# Altium project Power_Sys_Toplvl.PrjPCB (part 1 of 2)
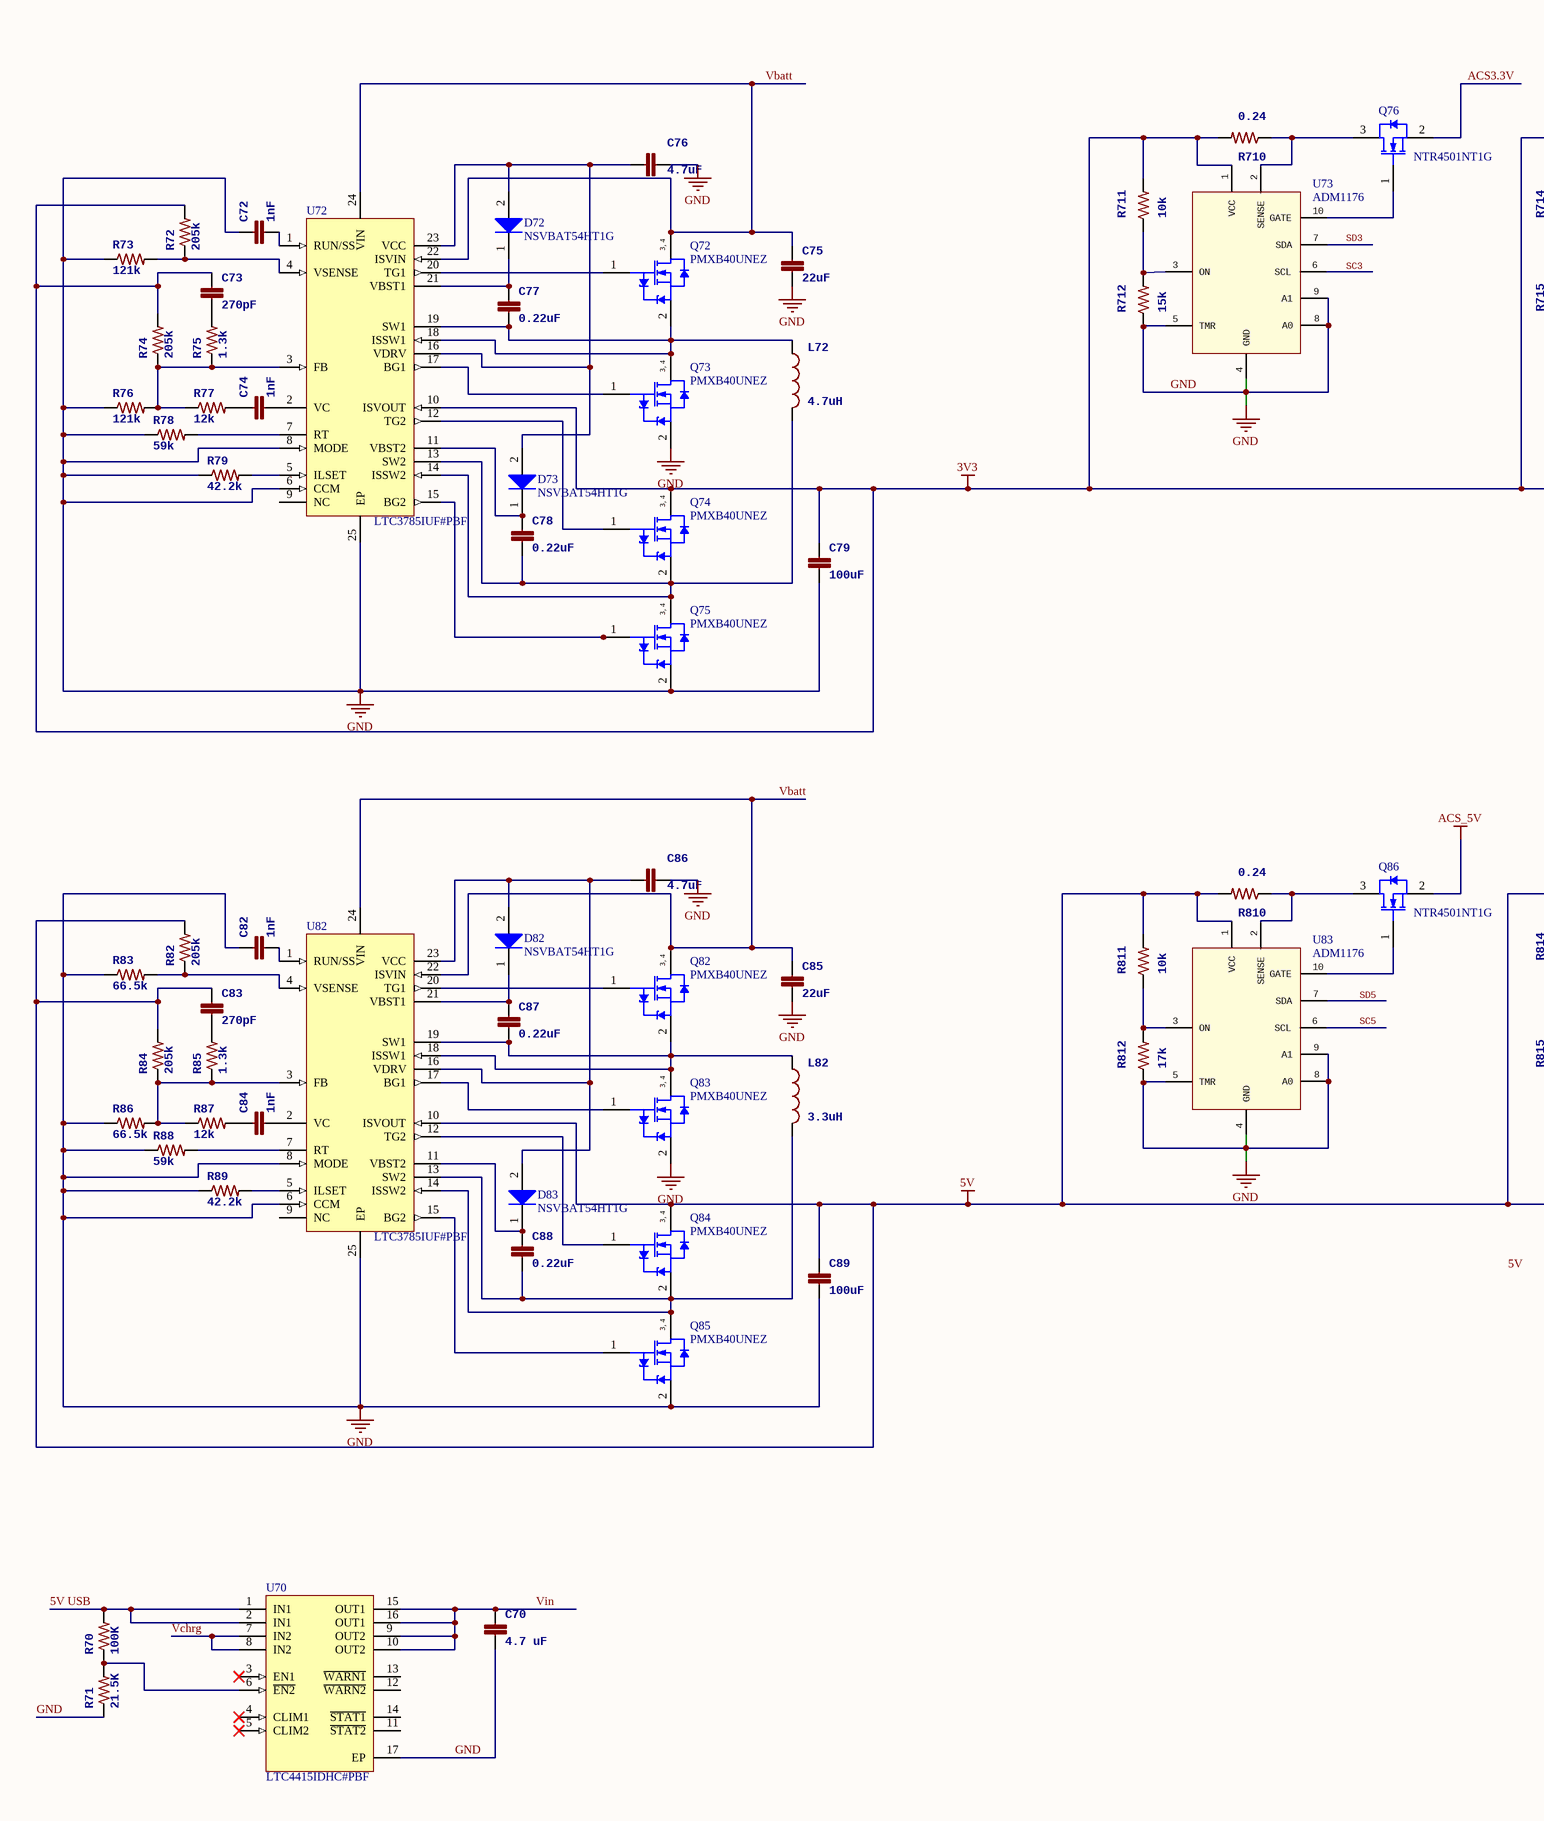
[diagram p0: BCR.SchDoc, left]
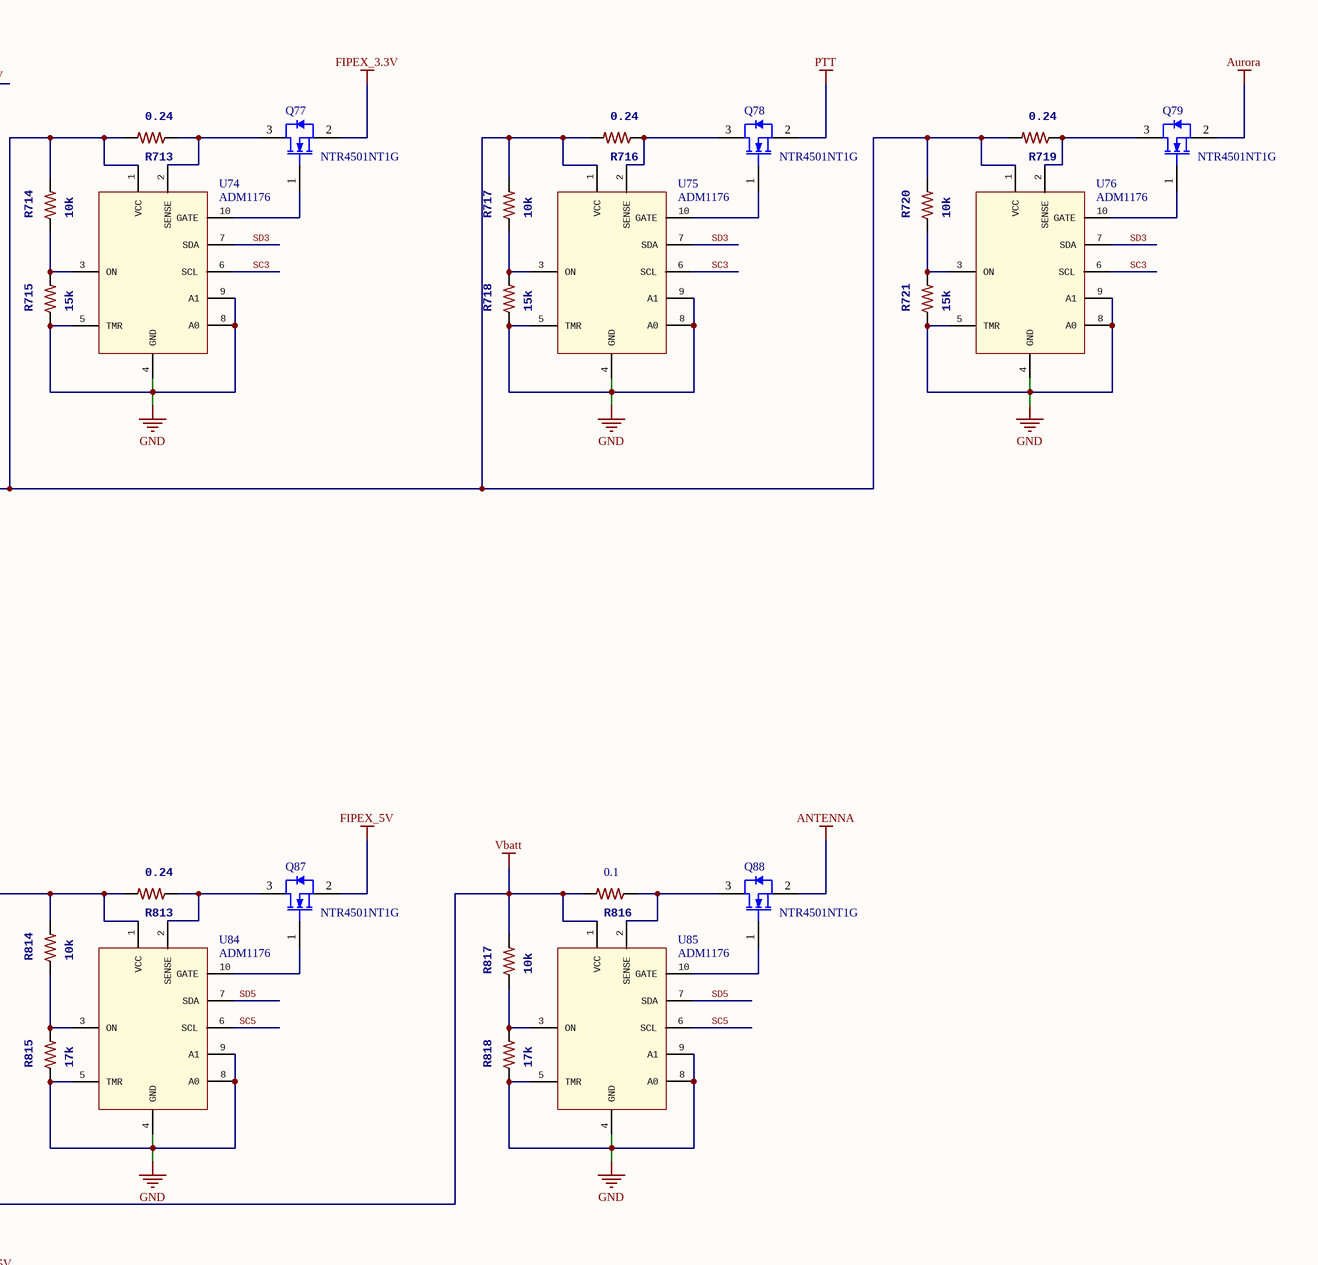
[diagram p1: BCR.SchDoc, right]
12 sheets, 551 parts. Net scope: hierarchical (ports join the sheet entries above them; power ports are global).
Sheets:
  BCR.SchDoc
  MPPT_Measurements.SchDoc
  MPPT-BCR.SchDoc
  power_board_uC.SchDoc
  Power_Sys_Toplvl.SchDoc
    PowerBoard = power_board_2.SchDoc.SchDoc
    SolarArray1 = SolarArray1.SchDoc
    SolarArray2 = SolarArray2.SchDoc
    SolarArray3 = SolarArray3.SchDoc
    SolarArray4 = SolarArray4.SchDoc
    SolarArrayTop = SolarArrayTop.SchDoc
    BatteryBoard = Battery4p.SchDoc

## Sheet BCR.SchDoc
size A2; Author: H. Chesser; DrawnBy: H. Chesser

### Parts
C70  4.7 uF  [0805]
C72  1nF  [0402-CAP]
C73  270pF  [0402-CAP]
C74  1nF  [0402-CAP]
C75  22uF  [0805]
C76  4.7uF  [0805]
C77  0.22uF  [0805]
C78  0.22uF  [0805]
C79  100uF  [0805]
C82  1nF  [0402-CAP]
C83  270pF  [0402-CAP]
C84  1nF  [0402-CAP]
C85  22uF  [0805]
C86  4.7uF  [0805]
C87  0.22uF  [0805]
C88  0.22uF  [0805]
C89  100uF  [0805]
D72  NSVBAT54HT1G  [ONSC-SOD-323-2-477-02_V]
D73  NSVBAT54HT1G  [ONSC-SOD-323-2-477-02_V]
D82  NSVBAT54HT1G  [ONSC-SOD-323-2-477-02_V]
D83  NSVBAT54HT1G  [ONSC-SOD-323-2-477-02_V]
L72  4.7uH  [1007]
L82  3.3uH  [1007]
Q72  PMXB40UNEZ  [NXP-SOT1215_M]
Q73  PMXB40UNEZ  [NXP-SOT1215_M]
Q74  PMXB40UNEZ  [NXP-SOT1215_M]
Q75  PMXB40UNEZ  [NXP-SOT1215_M]
Q76  NTR4501NT1G  [ONSC-SOT-23-3-318-08_V]
Q77  NTR4501NT1G  [ONSC-SOT-23-3-318-08_V]
Q78  NTR4501NT1G  [ONSC-SOT-23-3-318-08_V]
Q79  NTR4501NT1G  [ONSC-SOT-23-3-318-08_V]
Q82  PMXB40UNEZ  [NXP-SOT1215_M]
Q83  PMXB40UNEZ  [NXP-SOT1215_M]
Q84  PMXB40UNEZ  [NXP-SOT1215_M]
Q85  PMXB40UNEZ  [NXP-SOT1215_M]
Q86  NTR4501NT1G  [ONSC-SOT-23-3-318-08_V]
Q87  NTR4501NT1G  [ONSC-SOT-23-3-318-08_V]
Q88  NTR4501NT1G  [ONSC-SOT-23-3-318-08_V]
R70  100K  [0805]
R71  21.5K  [0805]
R72  205k  [0603-RES]
R73  121k  [0603-RES]
R74  205k  [0603-RES]
R75  1.3k  [0603-RES]
R76  121k  [0603-RES]
R77  12k  [0603-RES]
R78  59k  [0603-RES]
R79  42.2k  [0603-RES]
R82  205k  [0603-RES]
R83  66.5k  [0603-RES]
R84  205k  [0603-RES]
R85  1.3k  [0603-RES]
R86  66.5k  [0603-RES]
R87  12k  [0603-RES]
R88  59k  [0603-RES]
R89  42.2k  [0603-RES]
R710  0.24  [RESC1220X06N]
R711  10k  [0603-RES]
R712  15k  [0603-RES]
R713  0.24  [RESC1220X06N]
R714  10k  [0603-RES]
R715  15k  [0603-RES]
R716  0.24  [RESC1220X06N]
R717  10k  [0603-RES]
R718  15k  [0603-RES]
R719  0.24  [RESC1220X06N]
R720  10k  [0603-RES]
R721  15k  [0603-RES]
R810  0.24  [RESC1220X06N]
R811  10k  [0603-RES]
R812  17k  [0603-RES]
R813  0.24  [RESC1220X06N]
R814  10k  [0603-RES]
R815  17k  [0603-RES]
R816  value 0.1  [0603-RES]  (hidden comment: 0603)
R817  10k  [0603-RES]
R818  17k  [0603-RES]
U70  LTC4415IDHC#PBF  [LT-DHC-16_A_V]
U72  LTC3785IUF#PBF  [LT-UF-24_M]
U73  ADM1176  [MSOP-10]
U74  ADM1176  [MSOP-10]
U75  ADM1176  [MSOP-10]
U76  ADM1176  [MSOP-10]
U82  LTC3785IUF#PBF  [LT-UF-24_M]
U83  ADM1176  [MSOP-10]
U84  ADM1176  [MSOP-10]
U85  ADM1176  [MSOP-10]

### Nets
3V3: C73.1 C79.1 Q74.3(D) Q74.4(D) R72.2 R74.2 R710.2 R711.2 R713.2 R714.2 R716.2 R717.2 R719.2 R720.2 U72.10(ISVOUT) U73.1(VCC) U74.1(VCC) U75.1(VCC) U76.1(VCC)
5V: C75.1 C83.1 C85.1 C89.1 Q72.3(D) Q72.4(D) Q82.3(D) Q82.4(D) Q84.3(D) Q84.4(D) R82.2 R84.2 R810.2 R811.2 R813.2 R814.2 R816.2 R817.2 U72.22(ISVIN) U72.24(VIN) U82.10(ISVOUT) U82.22(ISVIN) U82.24(VIN) U83.1(VCC) U84.1(VCC) U85.1(VCC)  [also labelled Vbatt]
ACS_5V: Q86.2(S)
ANTENNA: Q88.2(S)
Aurora: Q79.2(S)
FIPEX_3.3V: Q77.2(S)
FIPEX_5V: Q87.2(S)
GND: C70.2 C72.1 C75.2 C76.2 C79.2 C82.1 C85.2 C86.2 C89.2 Q73.2(S) Q75.2(S) Q83.2(S) Q85.2(S) R71.1 R73.1 R76.1 R78.1 R79.1 R83.1 R86.1 R88.1 R89.1 R712.1 R715.1 R718.1 R721.1 R812.1 R815.1 R818.1 U70.17(EP) U72.6(CCM) U72.8(MODE) U72.25(EP) U73.4(GND) U73.5(TMR) U73.8(A0) U73.9(A1) U74.4(GND) U74.5(TMR) U74.8(A0) U74.9(A1) U75.4(GND) U75.5(TMR) U75.8(A0) U75.9(A1) U76.4(GND) U76.5(TMR) U76.8(A0) U76.9(A1) U82.6(CCM) U82.8(MODE) U82.25(EP) U83.4(GND) U83.5(TMR) U83.8(A0) U83.9(A1) U84.4(GND) U84.5(TMR) U84.8(A0) U84.9(A1) U85.4(GND) U85.5(TMR) U85.8(A0) U85.9(A1)  [project net ARRAYNX.3.NEG.NEG]
PTT: Q78.2(S)
5V USB: R70.2 U70.1(IN1) U70.2(IN1)
ACS3.3V: Q76.2(S)
SC3: U74.6(SCL) U75.6(SCL) U76.6(SCL)
SC5: U83.6(SCL) U84.6(SCL) U85.6(SCL)
SD3: U73.7(SDA) U74.7(SDA) U75.7(SDA) U76.7(SDA)
SD5: U84.7(SDA) U85.7(SDA)
Vchrg: U70.7(IN2) U70.8(IN2)
Vin: C70.1 U70.9(OUT2) U70.10(OUT2) U70.15(OUT1) U70.16(OUT1)
NetC72_2: C72.2 U72.1(RUN/SS)
NetC73_2: C73.2 R75.2
NetC74_1: C74.1 R77.2
NetC74_2: C74.2 U72.2(VC)
NetC76_1: C76.1 D72.2(A) D73.2(A) U72.16(VDRV) U72.23(VCC)
NetC77_1: C77.1 D72.1(K) U72.21(VBST1)
NetC77_2: C77.2 L72.1 Q72.2(S) Q73.3(D) Q73.4(D) U72.18(ISSW1) U72.19(SW1)
NetC78_1: C78.1 D73.1(K) U72.11(VBST2)
NetC78_2: C78.2 L72.2 Q74.2(S) Q75.3(D) Q75.4(D) U72.13(SW2) U72.14(ISSW2)
NetC82_2: C82.2 U82.1(RUN/SS)
NetC83_2: C83.2 R85.2
NetC84_1: C84.1 R87.2
NetC84_2: C84.2 U82.2(VC)
NetC86_1: C86.1 D82.2(A) D83.2(A) U82.16(VDRV) U82.23(VCC)
NetC87_1: C87.1 D82.1(K) U82.21(VBST1)
NetC87_2: C87.2 L82.1 Q82.2(S) Q83.3(D) Q83.4(D) U82.18(ISSW1) U82.19(SW1)
NetC88_1: C88.1 D83.1(K) U82.11(VBST2)
NetC88_2: C88.2 L82.2 Q84.2(S) Q85.3(D) Q85.4(D) U82.13(SW2) U82.14(ISSW2)
NetQ72_1: Q72.1(G) U72.20(TG1)
NetQ73_1: Q73.1(G) U72.17(BG1)
NetQ74_1: Q74.1(G) U72.12(TG2)
NetQ75_1: Q75.1(G) U72.15(BG2)
NetQ76_1: Q76.1(G) U73.10(GATE)
NetQ76_3: Q76.3(D) R710.1 U73.2(SENSE)
NetQ77_1: Q77.1(G) U74.10(GATE)
NetQ77_3: Q77.3(D) R713.1 U74.2(SENSE)
NetQ78_1: Q78.1(G) U75.10(GATE)
NetQ78_3: Q78.3(D) R716.1 U75.2(SENSE)
NetQ79_1: Q79.1(G) U76.10(GATE)
NetQ79_3: Q79.3(D) R719.1 U76.2(SENSE)
NetQ82_1: Q82.1(G) U82.20(TG1)
NetQ83_1: Q83.1(G) U82.17(BG1)
NetQ84_1: Q84.1(G) U82.12(TG2)
NetQ85_1: Q85.1(G) U82.15(BG2)
NetQ86_1: Q86.1(G) U83.10(GATE)
NetQ86_3: Q86.3(D) R810.1 U83.2(SENSE)
NetQ87_1: Q87.1(G) U84.10(GATE)
NetQ87_3: Q87.3(D) R813.1 U84.2(SENSE)
NetQ88_1: Q88.1(G) U85.10(GATE)
NetQ88_3: Q88.3(D) R816.1 U85.2(SENSE)
NetR70_1: R70.1 R71.2 U70.6(~{EN2})
NetR72_1: R72.1 R73.2 U72.4(VSENSE)
NetR74_1: R74.1 R75.1 R76.2 R77.1 U72.3(FB)
NetR78_2: R78.2 U72.7(RT)
NetR79_2: R79.2 U72.5(ILSET)
NetR82_1: R82.1 R83.2 U82.4(VSENSE)
NetR84_1: R84.1 R85.1 R86.2 R87.1 U82.3(FB)
NetR88_2: R88.2 U82.7(RT)
NetR89_2: R89.2 U82.5(ILSET)
NetR711_1: R711.1 R712.2 U73.3(ON)
NetR714_1: R714.1 R715.2 U74.3(ON)
NetR717_1: R717.1 R718.2 U75.3(ON)
NetR720_1: R720.1 R721.2 U76.3(ON)
NetR811_1: R811.1 R812.2 U83.3(ON)
NetR814_1: R814.1 R815.2 U84.3(ON)
NetR817_1: R817.1 R818.2 U85.3(ON)

Not connected (* = marked no-connect by the designer): U70 3(EN1)* 4(CLIM1)* 5(CLIM2)* 11(~{STAT2}) 12(~{WARN2}) 13(~{WARN1}) 14(~{STAT1}); U72 9(NC); U73 6(SCL); U82 9(NC); U83 7(SDA)

### Notes on the sheet
- Labels drawn without touching a wire or pin: 5V, SC3, SD5
- (in symbol CMP-1258-00046-1) 3, 4

### Library data of the parts
C70 = CAP0805_4700nF: Tolerance: ±10%; Voltage - Rated: 10V; Temperature Coefficient: X5R; RoHS: RoHS Compliant; Category: Capacitors; Packaging: Tape & Reel (TR); Mounting Type: Surface Mount, MLCC; Operating Temperature: -55°C ~ 125°C; Applications: General Purpose; Ratings: -; Package / Case: 0805 (2012 Metric); Size / Dimension: 0.079" L x 0.049" W (2.00mm x 1.25mm); Thickness (Max): 0.039" (1.00mm); Value: 4.7 uF; Supplier 1: Digi-Key; Supplier Part Number 1: 709-1230-1-ND
C72-C74 C82-C84 = CAP0402-CAP: Supplier 1: Digi-Key
  C72 C74 C82 C84: Supplier Part Number 1: 490-1303-1-ND
  C73 C83: Supplier Part Number 1: 1276-1673-1-ND
C75-C79 C85-C89 = CAP0805: Manufacturer: Kemet; Manufacturer Part Number: C0805C105K8RACTU; Tolerance: ±10%; Voltage - Rated: 10V; Temperature Coefficient: X7R; RoHS: RoHS Compliant; Category: Capacitors; Packaging: Tape & Reel (TR); Mounting Type: Surface Mount, MLCC; Operating Temperature: -55°C ~ 125°C; Applications: General Purpose; Ratings: -; Package / Case: 0805 (2012 Metric); Size / Dimension: 0.079" L x 0.049" W (2.00mm x 1.25mm); Height - Seated (Max): -; Thickness (Max): 0.039" (1.00mm); Lead Spacing: -; Features: -; Lead Style: -; ComponentLink1URL: http://www.kemet.com/docfinder?Partnumber=C0805C105K8RACTU; ComponentLink1Description: http://www.kemet.com/docfinder?Partnumber=C0805C105K8RACTU; Supplier 1: Digi-Key
  C75 C85: Supplier Part Number 1: 490-1719-1-ND
  C76 C86: Supplier Part Number 1: 490-3338-1-ND
  C77 C78 C87 C88: Supplier Part Number 1: 490-1670-1-ND
  C79 C89: Supplier Part Number 1: 490-10510-1-ND
D72 D73 D82 D83 = CMP-1055-00464-1: Schottky Barrier Diode, 2-Pin SOD-323, Pb-Free, Tape and Reel; Manufacturer: On Semiconductor; Configuration: Single; IFSM Max (A): 0.6; trr Max (ns): 5; ComponentLink1URL: http://www.onsemi.com/; ComponentLink2URL: http://www.onsemi.cn/pub_link/Collateral/BAT54HT1-D.PDF; ComponentLink2Description: Datasheet; PackageReference: SOD-323-2-477-02; ComponentLink3URL: http://www.onsemi.com/pub_link/Collateral/477-02.PDF.1; Mounting Technology: Surface Mount; DatasheetVersion: Rev. 6; PartNumber: NSVBAT54HT1G; ComponentLink3Description: Package Specification; PackageDescription: 2-Pin SOD, Body 1.7 x 1.25 mm; RoHS: TRUE; PackageVersion: Rev. H, 03/2007; Packing: Tape and Reel; ComponentLink1Description: Manufacturer URL
L72 L82 = INDUCTOR1007: Supplier 1: Digi-Key
  L72: Supplier Part Number 1: 587-1621-1-ND
  L82: Supplier Part Number 1: 587-2186-1-ND
Q72-Q75 Q82-Q85 = CMP-1258-00046-1: N-Channel Trench MOSFET, 12 V, 3.2 A, -55 to 150 degC, 4-Pin SOT1215; Manufacturer: NXP Semiconductors; VDS [max] (V): 12; Coss [typ] (pF): 107; Ciss [typ] (pF): 556; Channel Type: N; VGSth [typ] (V): 0.65; ID [max] (A): 3.2; ComponentLink1URL: http://www.nxp.com/; PackageVersion: 13-03-06, 03/2013; ComponentLink2URL: http://www.nxp.com/documents/data_sheet/PMXB40UNE.pdf; PartNumber: PMXB40UNEZ; PackageReference: SOT1215; Mounting Technology: Surface Mount; ComponentLink2Description: Datasheet; ComponentLink3URL: http://www.nxp.com/documents/outline_drawing/sot1215_po.pdf; ComponentLink3Description: Package Specification; PackageDescription: 3-Pin Small Outline No-Lead, Body 1.1 x 1 mm, Pitch 0.75 mm; ComponentLink1Description: Manufacturer URL; DatasheetVersion: Rev. 1
Q76-Q79 Q86-Q88 = CMP-1058-00732-1: Power MOSFET, 20 V, 3.2 A, Single N-Channel, 3-Pin SOT-23, Pb-Free, Tape and Reel; Manufacturer: On Semiconductor; VGS Max (V): 12; VGS(th) Max (V): 1.2; PD Max (W): 1.25; Coss Typ (pF): 80; Ciss Typ (pF): 200; V(BR)DSS Min (V): 20; Qrr Typ (nC): 3; Crss Typ (pF): 50; Channel Polarity: N Channel; RoHS: Pb-Free; ComponentLink3URL: http://www.onsemi.cn/pub_link/Collateral/318-08.PDF; ComponentLink2Description: Datasheet; PackageVersion: Rev. AP, 11/2009; Mounting Technology: Surface Mount; PackageDescription: 3-Pin Small Outline Transistor, Body 2.92 x 1.3 mm, Pitch 0.95 mm; PackageReference: SOT-23-3-318-08; ComponentLink1URL: http://www.onsemi.com/; Packing: Tape and Reel; Configuration: Single; ComponentLink2URL: http://www.onsemi.cn/pub_link/Collateral/NTR4501N-D.PDF; ComponentLink3Description: Package Specification; Package Type: SOT-23-3; ComponentLink1Description: Manufacturer URL; PartNumber: NTR4501NT1G; DatasheetVersion: Rev. 13
R70 = RES_0805_100K: Manufacturer: TE Connectivity; Manufacturer Part Number: 1625856-2; Resistance (Ohms): 10K; Tolerance: ±10%; Power (Watts): 0.125W, 1/8W; Temperature Coefficient: ±100ppm/°C; RoHS: RoHS Compliant; Category: Resistors; Packaging: Cut Tape (CT); Composition: Thick Film; Features: -; Operating Temperature: -55°C ~ 125°C; Package / Case: 0805 (2012 Metric); Supplier Device Package: 0805; Size / Dimension: 0.079" L x 0.047" W (2.00mm x 1.20mm); Height: 0.020" (0.50mm); Number of Terminations: 2; ComponentLink1URL: http://www.te.com/commerce/DocumentDelivery/DDEController?Action=srchrtrv&DocNm=1625856&DocType=Customer+Drawing&DocLang=English; ComponentLink1Description: http://www.te.com/commerce/DocumentDelivery/DDEController?Action=srchrtrv&DocNm=1625856&DocType=Customer+Drawing&DocLang=English; Value: 100K; Supplier 1: Digi-Key; Supplier Part Number 1: 311-100KCRCT-ND
R71 = RES_0805_21_5K: Manufacturer: TE Connectivity; Manufacturer Part Number: 1625856-2; Resistance (Ohms): 15K; Tolerance: ±10%; Power (Watts): 0.125W, 1/8W; Temperature Coefficient: ±100ppm/°C; RoHS: RoHS Compliant; Category: Resistors; Packaging: Cut Tape (CT); Composition: Thick Film; Features: -; Operating Temperature: -55°C ~ 125°C; Package / Case: 0805 (2012 Metric); Supplier Device Package: 0805; Size / Dimension: 0.079" L x 0.047" W (2.00mm x 1.20mm); Height: 0.020" (0.50mm); Number of Terminations: 2; ComponentLink1URL: http://www.te.com/commerce/DocumentDelivery/DDEController?Action=srchrtrv&DocNm=1625856&DocType=Customer+Drawing&DocLang=English; ComponentLink1Description: http://www.te.com/commerce/DocumentDelivery/DDEController?Action=srchrtrv&DocNm=1625856&DocType=Customer+Drawing&DocLang=English; Value: 21.5K; Supplier 1: Digi-Key; Supplier Part Number 1: 541-21.5KCCT-ND
R72-R79 R82-R89 R710-R721 R810-R815 R817 R818 = RESISTOR0603-RES: Supplier 1: Digi-Key
  R72 R74: Supplier Part Number 1: P205KHTR-ND
  R73 R76: Supplier Part Number 1: P121KHTR-ND
  R75 R85: Supplier Part Number 1: P1.30KHTR-ND
  R77: Supplier Part Number 1: P12.0KHTR-ND
  R78: Supplier Part Number 1: P59.0KHTR-ND
  R79 R89: Supplier Part Number 1: P42.2KHTR-ND
  R82: Supplier Part Number 1: P205KHCT-ND
  R83: Supplier Part Number 1: P66.5KHTR-ND
  R84: Supplier Part Number 1: P205KHDKR-ND
  R86: Supplier Part Number 1: P66.5KHCT-ND
  R87: Supplier Part Number 1: P12.0KHCT-ND
  R88: Supplier Part Number 1: P59.0KHCT-ND
  R710 R713 R716 R719 R810 R813: Supplier Part Number 1: P16011TR-ND
  R711 R714 R717 R720 R811 R814 R817: Supplier Part Number 1: P10.0KHTR-ND
  R712 R715 R718 R721: Supplier Part Number 1: P15.0KHTR-ND
  R812 R818: Supplier Part Number 1: P16.9KHCT-ND
  R815: Supplier Part Number 1: P16.9KHTR-ND
R816 = RESISTOR0603-RES: =Value; Supplier 1: Digi-Key; Supplier Part Number 1: 311-.10QCT-ND
U70 = CMP-0479-00074-1: Dual 4 A Ideal Diode with Adjustable Current Limit, Imon Output, Overcurrent Warning, Thermal Warning, 1.7 to 5.5 V Vin, 16-pin DFN (DHC-16_A), -40 to 125 degC, Pb-Free; Manufacturer: Linear Technology; Ideal Diode: Dual, Internal, P-Channel; Code_JEDEC: MO-229; ComponentLink3URL: http://cds.linear.com/docs/en/datasheet/4415fa.pdf; ComponentLink2URL: http://cds.linear.com/docs/en/datasheet/4415fa.pdf; Mounting Technology: Surface Mount; PackageDescription: 16-Pin Plastic DFN, Body 5 x 3 mm, Pitch 0.5 mm; ComponentLink1Description: Manufacturer URL; ComponentLink1URL: http://www.linear.com/; PackageVersion: Rev. Ø; PartNumber: LTC4415IDHC#PBF; PackageReference: DHC-16; ComponentLink3Description: Package Specification; DatasheetVersion: Rev. Ø; ComponentLink2Description: Datasheet; RoHS: TRUE
U72 U82 = CMP-0492-02264-1: High Efficiency, Synchronous, No Rsense Buck-Boost Controller, 24-pin QFN (UF24), -40 to 125 degC, Pb-Free; Manufacturer: Linear Technology; Number of Outputs: 1; Code_JEDEC: MO-220; PartNumber: LTC3785IUF#PBF; ComponentLink1Description: Manufacturer URL; PackageReference: UF24; ComponentLink3Description: Package Specification; PackageDescription: 24-Pin Plastic QFN, Body 4 x 4 mm, Pitch 0.5 mm; PackageVersion: Rev. B, 02/2012; ComponentLink1URL: http://www.linear.com/; ComponentLink3URL: http://cds.linear.com/docs/en/packaging/%28UF24%29%20QFN%2005-08-1697%20Rev%20B.pdf; ComponentLink2Description: Datasheet; DatasheetVersion: Rev. C; ComponentLink2URL: http://cds.linear.com/docs/en/datasheet/3785fc.pdf; RoHS: TRUE; Mounting Technology: Surface Mount
U73-U76 U83-U85 = ADM1176: DataSheet: http://www.analog.com/static/imported-files/data_sheets/ADM1176.pdf; MPN: ADM1176; Supplier 1: Digi-Key; Supplier Part Number 1: ADM1176-1ARMZ-R7CT-ND

## Sheet MPPT_Measurements.SchDoc
size C
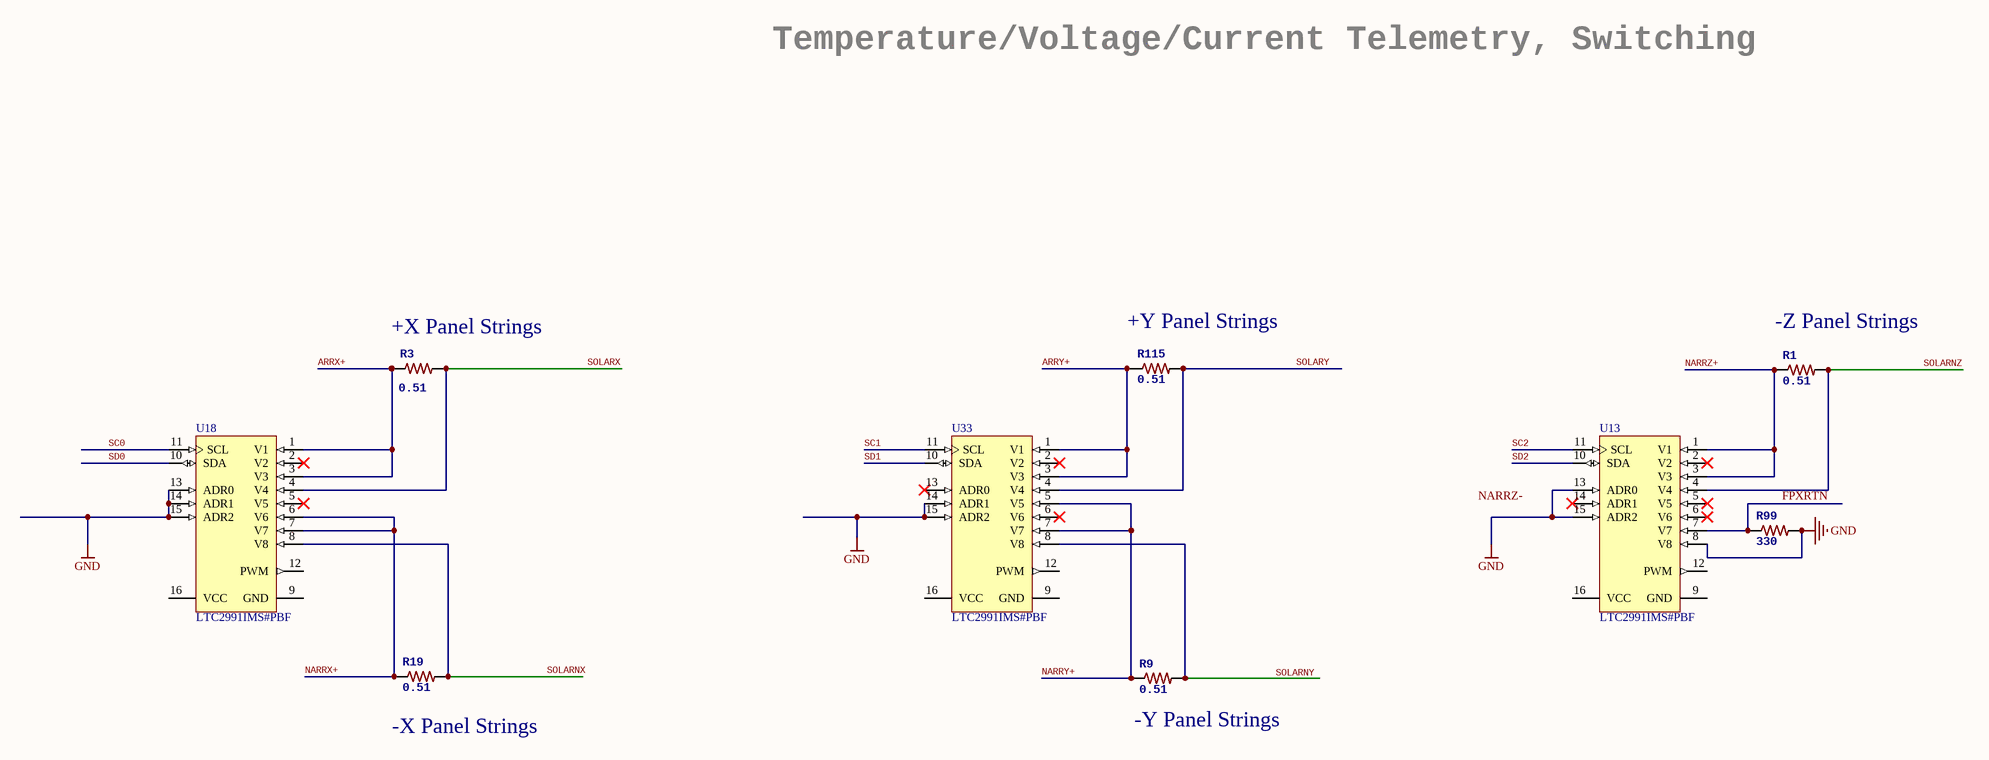
[diagram p2: MPPT_Measurements.SchDoc]

### Parts
(Parts that share a designator on the sheet are numbered #1, #2 ... from top to bottom, then left to right.)
R1#1  0.51  [RESC1220X06N]
R3#1  0.51  [RESC1220X06N]
R9  0.51  [RESC1220X06N]
R19  0.51  [RESC1220X06N]
R99  330  [0603-RES]
R115  0.51  [RESC1220X06N]
U13  LTC2991IMS#PBF  [LT-MS-16_N]
U18  LTC2991IMS#PBF  [LT-MS-16_N]
U33  LTC2991IMS#PBF  [LT-MS-16_N]

### Nets
GND: R99.2 U13.8(V8) U13.13(ADR0) U13.15(ADR2) U18.13(ADR0) U18.14(ADR1) U18.15(ADR2) U33.14(ADR1) U33.15(ADR2)  [project net ARRAYNX.3.NEG.NEG]
ARRX+: R3#1.1 U18.1(V1) U18.3(V3)
ARRY+: R115.1 U33.1(V1) U33.3(V3)
FPXRTN: R99.1 U13.7(V7)
NARRX+: R19.1 U18.6(V6) U18.7(V7)
NARRY+: R9.1 U33.5(V5) U33.7(V7)
NARRZ+: R1#1.1 U13.1(V1) U13.3(V3)
SC0: U18.11(SCL)
SC1: U33.11(SCL)
SC2: U13.11(SCL)
SD0: U18.10(SDA)
SD1: U33.10(SDA)
SD2: U13.10(SDA)
SOLARNX: R19.2 U18.8(V8)
SOLARNZ: R1#1.2 U13.4(V4)
SOLARX: R3#1.2 U18.4(V4)
SOLARY: R115.2 U33.4(V4)
NetR9_2: R9.2 U33.8(V8)

Not connected (* = marked no-connect by the designer): U13 2(V2)* 5(V5)* 6(V6)* 9(GND) 12(PWM) 14(ADR1)* 16(VCC); U18 2(V2)* 5(V5)* 9(GND) 12(PWM) 16(VCC); U33 2(V2)* 6(V6)* 9(GND) 12(PWM) 13(ADR0)* 16(VCC)

### Notes on the sheet
- Temperature/Voltage/Current Telemetry, Switching
- (near R3#1) +X Panel Strings
- (near R115) +Y Panel Strings
- (near R1#1) -Z Panel Strings
- (near R19) -X Panel Strings
- (near R9) -Y Panel Strings
- Labels drawn without touching a wire or pin: NARRZ-, SOLARNY

### Library data of the parts
R1#1 R9 R19 R115 = RESISTOR: <b>Resistor</b> / Basic schematic elements and footprints for 0603, 1206, and PTH resistors.; Supplier 1: Digi-Key; Supplier Part Number 1: RHM.51BSTR-ND; Value: 0.51
R3#1 = RESISTOR: <b>Resistor</b> / Basic schematic elements and footprints for 0603, 1206, and PTH resistors.; pin to pad: A1 A2 A3>P2 B1 B2 B3>P1; Supplier 1: Digi-Key; Supplier Part Number 1: RHM.51BSTR-ND; Value: 0.51
R99 = RESISTOR0805-RES_333: Manufacturer: TE Connectivity; Manufacturer Part Number: 1625856-2; Tolerance: ±10%; Power (Watts): 0.125W, 1/8W; Temperature Coefficient: ±100ppm/°C; RoHS: RoHS Compliant; Category: Resistors; Packaging: Cut Tape (CT); Value: 330; Composition: Thick Film; Features: -; Operating Temperature: -55°C ~ 125°C; Package / Case: 0805 (2012 Metric); Supplier Device Package: 0805; Size / Dimension: 0.079" L x 0.047" W (2.00mm x 1.20mm); Height: 0.020" (0.50mm); Number of Terminations: 2; ComponentLink1URL: http://www.te.com/commerce/DocumentDelivery/DDEController?Action=srchrtrv&DocNm=1625856&DocType=Customer+Drawing&DocLang=English; ComponentLink1Description: http://www.te.com/commerce/DocumentDelivery/DDEController?Action=srchrtrv&DocNm=1625856&DocType=Customer+Drawing&DocLang=English; Supplier 1: Digi-Key; Supplier Part Number 1: P332DBCT-ND
U13 U18 U33 = CMP-0482-00817-1: Octal I2C Voltage, Current, and Temperature Monitor, 16-pin SOP (MS-16), -40 to 85 degC, Pb-Free; Manufacturer: Linear Technology; Number of Supplies(#): 8; PackageDescription: 16-Pin Plastic MSOP, Body 4.04 x 3.00 mm, Pitch 0.50 mm; ComponentLink3Description: Package Specification; RoHS: TRUE; ComponentLink1URL: http://www.linear.com/; DatasheetVersion: Rev. B; ComponentLink1Description: Manufacturer URL; ComponentLink2Description: Datasheet; ComponentLink2URL: http://cds.linear.com/docs/en/datasheet/2991fb.pdf; PackageReference: MS16; PartNumber: LTC2991IMS#PBF; PackageVersion: Rev. Ø, 06/2010; ComponentLink3URL: http://cds.linear.com/docs/en/packaging/05081669_A_MS16.pdf; Mounting Technology: Surface Mount

## Sheet MPPT-BCR.SchDoc
size C
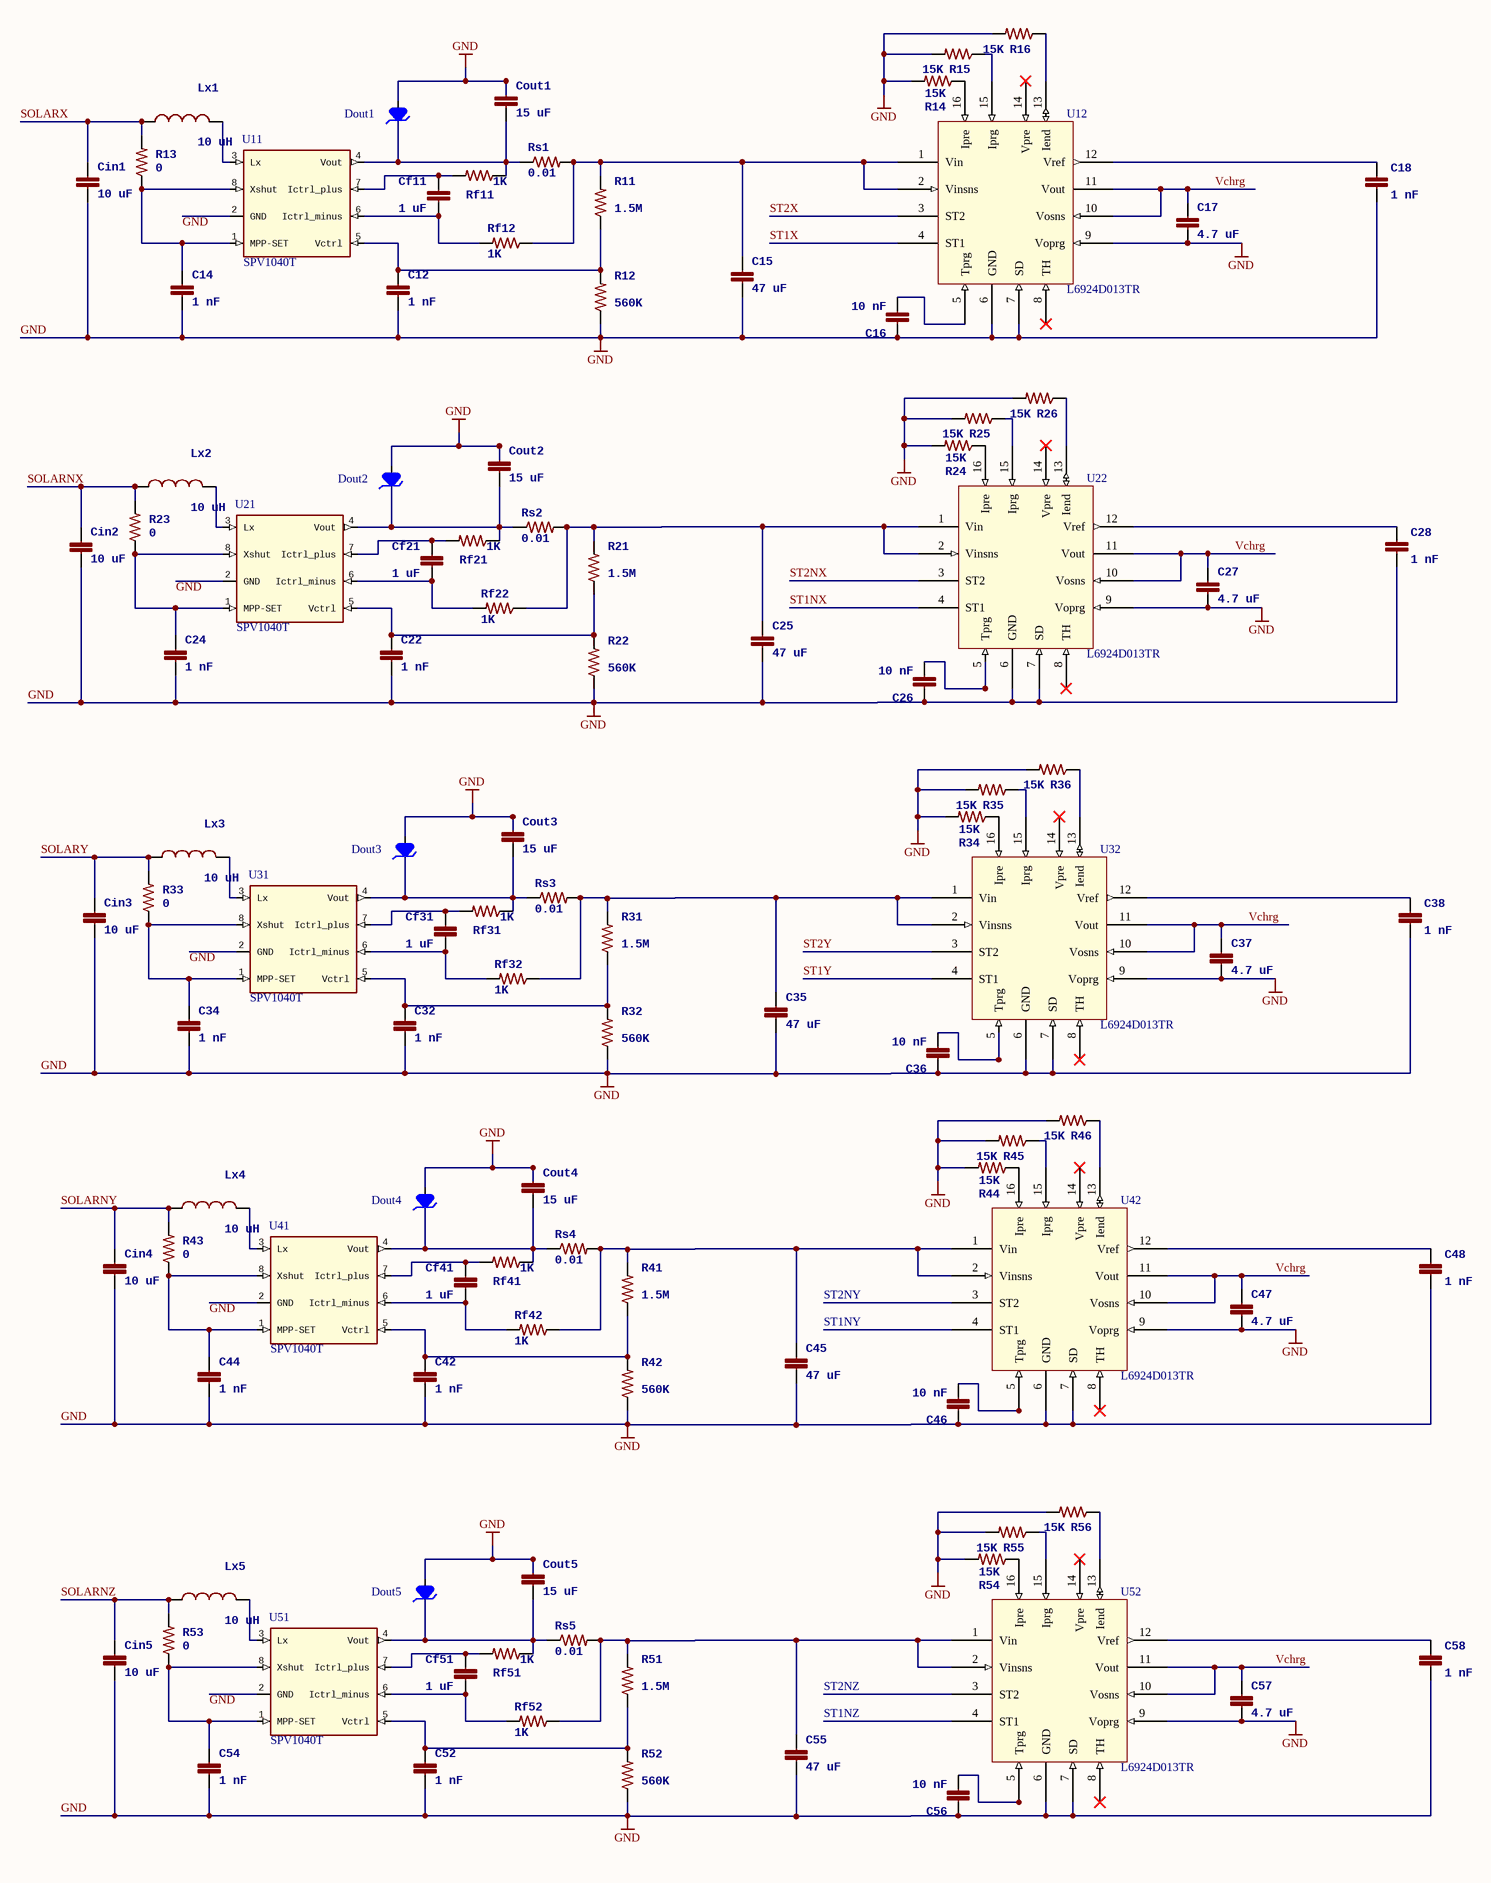
[diagram p3: MPPT-BCR.SchDoc]

### Parts
C12  1 nF  [0805]
C14  1 nF  [0805]
C15  47 uF  [0805]
C16  10 nF  [0805]
C17  4.7 uF  [0805]
C18  1 nF  [0805]
C22  1 nF  [0805]
C24  1 nF  [0805]
C25  47 uF  [0805]
C26  10 nF  [0805]
C27  4.7 uF  [0805]
C28  1 nF  [0805]
C32  1 nF  [0805]
C34  1 nF  [0805]
C35  47 uF  [0805]
C36  10 nF  [0805]
C37  4.7 uF  [0805]
C38  1 nF  [0805]
C42  1 nF  [0805]
C44  1 nF  [0805]
C45  47 uF  [0805]
C46  10 nF  [0805]
C47  4.7 uF  [0805]
C48  1 nF  [0805]
C52  1 nF  [0805]
C54  1 nF  [0805]
C55  47 uF  [0805]
C56  10 nF  [0805]
C57  4.7 uF  [0805]
C58  1 nF  [0805]
Cf11  1 uF  [0805]
Cf21  1 uF  [0805]
Cf31  1 uF  [0805]
Cf41  1 uF  [0805]
Cf51  1 uF  [0805]
Cin1  10 uF  [0805]
Cin2  10 uF  [0805]
Cin3  10 uF  [0805]
Cin4  10 uF  [0805]
Cin5  10 uF  [0805]
Cout1  15 uF  [1210]
Cout2  15 uF  [1210]
Cout3  15 uF  [1210]
Cout4  15 uF  [1210]
Cout5  15 uF  [1210]
Dout1  Diode_Zener  [STmite]  (value not drawn)
Dout2  Diode_Zener  [STmite]  (value not drawn)
Dout3  Diode_Zener  [STmite]  (value not drawn)
Dout4  Diode_Zener  [STmite]  (value not drawn)
Dout5  Diode_Zener  [STmite]  (value not drawn)
Lx1  10 uH  [1007]
Lx2  10 uH  [1007]
Lx3  10 uH  [1007]
Lx4  10 uH  [1007]
Lx5  10 uH  [1007]
R11  1.5M  [0805]
R12  560K  [0805]
R13  0  [0805]
R14  15K  [0805]
R15  15K  [0805]
R16  15K  [0805]
R21  1.5M  [0805]
R22  560K  [0805]
R23  0  [0805]
R24  15K  [0805]
R25  15K  [0805]
R26  15K  [0805]
R31  1.5M  [0805]
R32  560K  [0805]
R33  0  [0805]
R34  15K  [0805]
R35  15K  [0805]
R36  15K  [0805]
R41  1.5M  [0805]
R42  560K  [0805]
R43  0  [0805]
R44  15K  [0805]
R45  15K  [0805]
R46  15K  [0805]
R51  1.5M  [0805]
R52  560K  [0805]
R53  0  [0805]
R54  15K  [0805]
R55  15K  [0805]
R56  15K  [0805]
Rf11  1K  [0805]
Rf12  1K  [0805]
Rf21  1K  [0805]
Rf22  1K  [0805]
Rf31  1K  [0805]
Rf32  1K  [0805]
Rf41  1K  [0805]
Rf42  1K  [0805]
Rf51  1K  [0805]
Rf52  1K  [0805]
Rs1  0.01  [0805]
Rs2  0.01  [0805]
Rs3  0.01  [0805]
Rs4  0.01  [0805]
Rs5  0.01  [0805]
U11  Manufacturer Part Number: SPV1040T  [TSSOP8]  (hidden comment: SPV1040)
U12  L6924D013TR  [VQFN16_AP]
U21  Manufacturer Part Number: SPV1040T  [TSSOP8]  (hidden comment: SPV1040)
U22  L6924D013TR  [VQFN16_AP]
U31  Manufacturer Part Number: SPV1040T  [TSSOP8]  (hidden comment: SPV1040)
U32  L6924D013TR  [VQFN16_AP]
U41  Manufacturer Part Number: SPV1040T  [TSSOP8]  (hidden comment: SPV1040)
U42  L6924D013TR  [VQFN16_AP]
U51  Manufacturer Part Number: SPV1040T  [TSSOP8]  (hidden comment: SPV1040)
U52  L6924D013TR  [VQFN16_AP]

### Nets
GND: C12.2 C14.2 C15.2 C16.1 C17.2 C18.2 C22.2 C24.2 C25.2 C26.1 C27.2 C28.2 C32.2 C34.2 C35.2 C36.1 C37.2 C38.2 C42.2 C44.2 C45.2 C46.1 C47.2 C48.2 C52.2 C54.2 C55.2 C56.1 C57.2 C58.2 Cin1.2 Cin2.2 Cin3.2 Cin4.2 Cin5.2 Cout1.1 Cout2.1 Cout3.1 Cout4.1 Cout5.1 Dout1.2 Dout2.2 Dout3.2 Dout4.2 Dout5.2 R12.1 R14.2 R15.2 R16.2 R22.1 R24.2 R25.2 R26.2 R32.1 R34.2 R35.2 R36.2 R42.1 R44.2 R45.2 R46.2 R52.1 R54.2 R55.2 R56.2 U12.6(GND) U12.7(SD) U12.9(Voprg) U22.6(GND) U22.7(SD) U22.9(Voprg) U32.6(GND) U32.7(SD) U32.9(Voprg) U42.6(GND) U42.7(SD) U42.9(Voprg) U52.6(GND) U52.7(SD) U52.9(Voprg)  [project net ARRAYNX.3.NEG.NEG]
SOLARNX: Cin2.1 Lx2.1 R23.2
SOLARNY: Cin4.1 Lx4.1 R43.2
SOLARNZ: Cin5.1 Lx5.1 R53.2
SOLARX: Cin1.1 Lx1.1 R13.2
SOLARY: Cin3.1 Lx3.1 R33.2
ST1NX: U22.4(ST1)
ST1X: U12.4(ST1)
ST1Y: U32.4(ST1)
ST2NX: U22.3(ST2)
ST2X: U12.3(ST2)
ST2Y: U32.3(ST2)
Vchrg: C17.1 C27.1 C37.1 C47.1 C57.1 U12.10(Vosns) U12.11(Vout) U22.10(Vosns) U22.11(Vout) U32.10(Vosns) U32.11(Vout) U42.10(Vosns) U42.11(Vout) U52.10(Vosns) U52.11(Vout)
NetC12_1: C12.1 R11.1 R12.2 U11.5(Vctrl)
NetC14_1: C14.1 R13.1 U11.1(MPP-SET) U11.8(Xshut)
NetC15_1: C15.1 R11.2 Rf12.1 Rs1.2 U12.1(Vin) U12.2(Vinsns)
NetC16_2: C16.2 U12.5(Tprg)
NetC18_1: C18.1 U12.12(Vref)
NetC22_1: C22.1 R21.1 R22.2 U21.5(Vctrl)
NetC24_1: C24.1 R23.1 U21.1(MPP-SET) U21.8(Xshut)
NetC25_1: C25.1 R21.2 Rf22.1 Rs2.2 U22.1(Vin) U22.2(Vinsns)
NetC26_2: C26.2 U22.5(Tprg)
NetC28_1: C28.1 U22.12(Vref)
NetC32_1: C32.1 R31.1 R32.2 U31.5(Vctrl)
NetC34_1: C34.1 R33.1 U31.1(MPP-SET) U31.8(Xshut)
NetC35_1: C35.1 R31.2 Rf32.1 Rs3.2 U32.1(Vin) U32.2(Vinsns)
NetC36_2: C36.2 U32.5(Tprg)
NetC38_1: C38.1 U32.12(Vref)
NetC42_1: C42.1 R41.1 R42.2 U41.5(Vctrl)
NetC44_1: C44.1 R43.1 U41.1(MPP-SET) U41.8(Xshut)
NetC45_1: C45.1 R41.2 Rf42.1 Rs4.2 U42.1(Vin) U42.2(Vinsns)
NetC46_2: C46.2 U42.5(Tprg)
NetC48_1: C48.1 U42.12(Vref)
NetC52_1: C52.1 R51.1 R52.2 U51.5(Vctrl)
NetC54_1: C54.1 R53.1 U51.1(MPP-SET) U51.8(Xshut)
NetC55_1: C55.1 R51.2 Rf52.1 Rs5.2 U52.1(Vin) U52.2(Vinsns)
NetC56_2: C56.2 U52.5(Tprg)
NetC58_1: C58.1 U52.12(Vref)
NetCf11_1: Cf11.1 Rf11.2 U11.7(Ictrl_plus)
NetCf11_2: Cf11.2 Rf12.2 U11.6(Ictrl_minus)
NetCf21_1: Cf21.1 Rf21.2 U21.7(Ictrl_plus)
NetCf21_2: Cf21.2 Rf22.2 U21.6(Ictrl_minus)
NetCf31_1: Cf31.1 Rf31.2 U31.7(Ictrl_plus)
NetCf31_2: Cf31.2 Rf32.2 U31.6(Ictrl_minus)
NetCf41_1: Cf41.1 Rf41.2 U41.7(Ictrl_plus)
NetCf41_2: Cf41.2 Rf42.2 U41.6(Ictrl_minus)
NetCf51_1: Cf51.1 Rf51.2 U51.7(Ictrl_plus)
NetCf51_2: Cf51.2 Rf52.2 U51.6(Ictrl_minus)
NetCout1_2: Cout1.2 Dout1.1 Rf11.1 Rs1.1 U11.4(Vout)
NetCout2_2: Cout2.2 Dout2.1 Rf21.1 Rs2.1 U21.4(Vout)
NetCout3_2: Cout3.2 Dout3.1 Rf31.1 Rs3.1 U31.4(Vout)
NetCout4_2: Cout4.2 Dout4.1 Rf41.1 Rs4.1 U41.4(Vout)
NetCout5_2: Cout5.2 Dout5.1 Rf51.1 Rs5.1 U51.4(Vout)
NetLx1_2: Lx1.2 U11.3(Lx)
NetLx2_2: Lx2.2 U21.3(Lx)
NetLx3_2: Lx3.2 U31.3(Lx)
NetLx4_2: Lx4.2 U41.3(Lx)
NetLx5_2: Lx5.2 U51.3(Lx)
NetR14_1: R14.1 U12.16(Ipre)
NetR15_1: R15.1 U12.15(Iprg)
NetR16_1: R16.1 U12.13(Iend)
NetR24_1: R24.1 U22.16(Ipre)
NetR25_1: R25.1 U22.15(Iprg)
NetR26_1: R26.1 U22.13(Iend)
NetR34_1: R34.1 U32.16(Ipre)
NetR35_1: R35.1 U32.15(Iprg)
NetR36_1: R36.1 U32.13(Iend)
NetR44_1: R44.1 U42.16(Ipre)
NetR45_1: R45.1 U42.15(Iprg)
NetR46_1: R46.1 U42.13(Iend)
NetR54_1: R54.1 U52.16(Ipre)
NetR55_1: R55.1 U52.15(Iprg)
NetR56_1: R56.1 U52.13(Iend)

Not connected (* = marked no-connect by the designer): U11 2(GND); U12 8(TH)* 14(Vpre)*; U21 2(GND); U22 8(TH)* 14(Vpre)*; U31 2(GND); U32 8(TH)* 14(Vpre)*; U41 2(GND); U42 3(ST2) 4(ST1) 8(TH)* 14(Vpre)*; U51 2(GND); U52 3(ST2) 4(ST1) 8(TH)* 14(Vpre)*

### Notes on the sheet
- ST2NY
- (near C45) ST1NY
- ST2NZ
- (near C55) ST1NZ
- Labels drawn without touching a wire or pin: GND

### Library data of the parts
C12 C14 C18 C22 C24 C28 C32 C34 C38 C42 C44 C48 C52 C54 C58 = CAP0805_1nF: Tolerance: ±10%; Voltage - Rated: 10V; Temperature Coefficient: X7R; RoHS: RoHS Compliant; Category: Capacitors; Packaging: Tape & Reel (TR); Mounting Type: Surface Mount, MLCC; Operating Temperature: -55°C ~ 125°C; Applications: General Purpose; Ratings: -; Package / Case: 0805 (2012 Metric); Size / Dimension: 0.079" L x 0.049" W (2.00mm x 1.25mm); Height - Seated (Max): -; Thickness (Max): 0.039" (1.00mm); Lead Spacing: -; Features: -; Lead Style: -; ComponentLink1URL: http://www.kemet.com/docfinder?Partnumber=C0805C105K8RACTU; ComponentLink1Description: http://www.kemet.com/docfinder?Partnumber=C0805C105K8RACTU; Value: 1 nF; Supplier 1: Digi-Key; Supplier Part Number 1: 445-1330-1-ND
C15 C25 C35 C45 C55 = CAP0805_47000nF: Tolerance: ±10%; Voltage - Rated: 10V; Temperature Coefficient: X5R; RoHS: RoHS Compliant; Category: Capacitors; Packaging: Tape & Reel (TR); Mounting Type: Surface Mount, MLCC; Operating Temperature: -55°C ~ 125°C; Applications: General Purpose; Ratings: -; Package / Case: 0805 (2012 Metric); Size / Dimension: 0.079" L x 0.049" W (2.00mm x 1.25mm); Thickness (Max): 0.039" (1.00mm); Value: 47 uF; Supplier 1: Digi-Key; Supplier Part Number 1: 399-5506-1-ND
C16 C26 C36 C46 C56 = CAP0805_10nF: Tolerance: ±10%; Voltage - Rated: 10V; Temperature Coefficient: X7R; RoHS: RoHS Compliant; Category: Capacitors; Packaging: Tape & Reel (TR); Mounting Type: Surface Mount, MLCC; Operating Temperature: -55°C ~ 125°C; Applications: General Purpose; Ratings: -; Package / Case: 0805 (2012 Metric); Size / Dimension: 0.079" L x 0.049" W (2.00mm x 1.25mm); Height - Seated (Max): -; Thickness (Max): 0.039" (1.00mm); Lead Spacing: -; Features: -; Lead Style: -; ComponentLink1URL: http://www.kemet.com/docfinder?Partnumber=C0805C105K8RACTU; ComponentLink1Description: http://www.kemet.com/docfinder?Partnumber=C0805C105K8RACTU; Value: 10 nF; Supplier 1: Digi-Key; Supplier Part Number 1: 1276-2437-1-ND
C17 C27 C37 C47 C57 = CAP0805_4700nF: as C70 on sheet BCR; RoHS: RoHS Compliant; Category: Capacitors; Packaging: Tape & Reel (TR); Mounting Type: Surface Mount, MLCC; Operating Temperature: -55°C ~ 125°C; Applications: General Purpose; Ratings: -; Package / Case: 0805 (2012 Metric); Size / Dimension: 0.079" L x 0.049" W (2.00mm x 1.25mm); Thickness (Max): 0.039" (1.00mm); Value: 4.7 uF; Supplier 1: Digi-Key; Supplier Part Number 1: 709-1230-1-ND
Cf11 Cf21 Cf31 Cf41 Cf51 = CAP0805_1uF: Manufacturer: Kemet; Manufacturer Part Number: C0805C105K8RACTU; Tolerance: ±10%; Voltage - Rated: 10V; Temperature Coefficient: X7R; RoHS: RoHS Compliant; Category: Capacitors; Packaging: Tape & Reel (TR); Mounting Type: Surface Mount, MLCC; Operating Temperature: -55°C ~ 125°C; Applications: General Purpose; Ratings: -; Package / Case: 0805 (2012 Metric); Size / Dimension: 0.079" L x 0.049" W (2.00mm x 1.25mm); Height - Seated (Max): -; Thickness (Max): 0.039" (1.00mm); Lead Spacing: -; Features: -; Lead Style: -; ComponentLink1URL: http://www.kemet.com/docfinder?Partnumber=C0805C105K8RACTU; ComponentLink1Description: http://www.kemet.com/docfinder?Partnumber=C0805C105K8RACTU; Value: 1 uF; Supplier 1: Digi-Key; Supplier Part Number 1: 445-1358-1-ND
Cin1-Cin5 = CAP0805_10uF: Tolerance: ±10%; Voltage - Rated: 10V; Temperature Coefficient: X5R; RoHS: RoHS Compliant; Category: Capacitors; Packaging: Tape & Reel (TR); Mounting Type: Surface Mount, MLCC; Operating Temperature: -55°C ~ 125°C; Applications: General Purpose; Ratings: -; Package / Case: 0805 (2012 Metric); Size / Dimension: 0.079" L x 0.049" W (2.00mm x 1.25mm); Thickness (Max): 0.039" (1.00mm); Supplier 1: Digi-Key; Supplier Part Number 1: 445-7660-1-ND; Value: 10 uF
Cout1-Cout5 = CAP0805_15uF: Tolerance: ±10%; Voltage - Rated: 10V; Temperature Coefficient: X5R; RoHS: RoHS Compliant; Category: Capacitors; Packaging: Tape & Reel (TR); Mounting Type: Surface Mount, MLCC; Operating Temperature: -55°C ~ 125°C; Applications: General Purpose; Ratings: -; Package / Case: 0805 (2012 Metric); Size / Dimension: 0.079" L x 0.049" W (2.00mm x 1.25mm); Thickness (Max): 0.039" (1.00mm); Value: 15 uF; Supplier 1: Digi-Key; Supplier Part Number 1: 445-3950-2-ND
Dout1-Dout5 = Diode_Zener: Voltage - Zener (Nom) (Vz): 3.3V; Tolerance: ±5%; Power - Max: 3W; Impedance (Max) (Zzt): 10 Ohm; Current - Reverse Leakage @ Vr: 100µA @ 1V; Voltage - Forward (Vf) (Max) @ If: 1.5V @ 200mA; Supplier 1: Digi-Key; RoHS: RoHS Compliant; Category: Discrete Semiconductor Products; Packaging: Cut Tape (CT); Operating Temperature: -65°C ~ 150°C; Mounting Type: Surface Mount; Package / Case: DO-220AA; Supplier Device Package: SMB; ComponentLink1URL: http://www.onsemi.com/pub_link/Collateral/1SMB5913BT3-D.PDF; ComponentLink1Description: http://www.onsemi.com/pub_link/Collateral/1SMB5913BT3-D.PDF; Supplier Part Number 1: 497-15660-1-ND
Lx1-Lx5 = INDUCTOR1007: Supplier 1: Digi-Key; Supplier Part Number 1: 587-1613-1-ND
R11 R21 R31 R41 R51 = RES_0805_1500K: Manufacturer: TE Connectivity; Manufacturer Part Number: 1625856-2; Tolerance: ±10%; Power (Watts): 0.125W, 1/8W; Temperature Coefficient: ±100ppm/°C; Supplier 1: Digi-Key; RoHS: RoHS Compliant; Category: Resistors; Packaging: Cut Tape (CT); Resistance (Ohms): 1.5M; Composition: Thick Film; Features: -; Operating Temperature: -55°C ~ 125°C; Package / Case: 0805 (2012 Metric); Supplier Device Package: 0805; Size / Dimension: 0.079" L x 0.047" W (2.00mm x 1.20mm); Height: 0.020" (0.50mm); Number of Terminations: 2; ComponentLink1URL: http://www.te.com/commerce/DocumentDelivery/DDEController?Action=srchrtrv&DocNm=1625856&DocType=Customer+Drawing&DocLang=English; ComponentLink1Description: http://www.te.com/commerce/DocumentDelivery/DDEController?Action=srchrtrv&DocNm=1625856&DocType=Customer+Drawing&DocLang=English; Supplier Part Number 1: A103799CT-ND; Value: 1.5M
R12 R22 R32 R42 R52 = RES_0805_560K: Manufacturer: TE Connectivity; Manufacturer Part Number: 1625856-2; Tolerance: ±10%; Power (Watts): 0.125W, 1/8W; Temperature Coefficient: ±100ppm/°C; Supplier 1: Digi-Key; RoHS: RoHS Compliant; Category: Resistors; Packaging: Cut Tape (CT); Resistance (Ohms): 560K; Composition: Thick Film; Features: -; Operating Temperature: -55°C ~ 125°C; Package / Case: 0805 (2012 Metric); Supplier Device Package: 0805; Size / Dimension: 0.079" L x 0.047" W (2.00mm x 1.20mm); Height: 0.020" (0.50mm); Number of Terminations: 2; ComponentLink1URL: http://www.te.com/commerce/DocumentDelivery/DDEController?Action=srchrtrv&DocNm=1625856&DocType=Customer+Drawing&DocLang=English; ComponentLink1Description: http://www.te.com/commerce/DocumentDelivery/DDEController?Action=srchrtrv&DocNm=1625856&DocType=Customer+Drawing&DocLang=English; Supplier Part Number 1: A103220CT-ND; Value: 560K
R13 R23 R33 R43 R53 = RES_0805_0: Manufacturer: TE Connectivity; Manufacturer Part Number: 1625856-2; Resistance (Ohms): 100M; Tolerance: ±10%; Power (Watts): 0.125W, 1/8W; Temperature Coefficient: ±100ppm/°C; Supplier 1: Digi-Key; RoHS: RoHS Compliant; Category: Resistors; Packaging: Cut Tape (CT); Composition: Thick Film; Features: -; Operating Temperature: -55°C ~ 125°C; Package / Case: 0805 (2012 Metric); Supplier Device Package: 0805; Size / Dimension: 0.079" L x 0.047" W (2.00mm x 1.20mm); Height: 0.020" (0.50mm); Number of Terminations: 2; ComponentLink1URL: http://www.te.com/commerce/DocumentDelivery/DDEController?Action=srchrtrv&DocNm=1625856&DocType=Customer+Drawing&DocLang=English; ComponentLink1Description: http://www.te.com/commerce/DocumentDelivery/DDEController?Action=srchrtrv&DocNm=1625856&DocType=Customer+Drawing&DocLang=English; Supplier Part Number 1: RHM0.0ARCT-ND; Value: 0
R14-R16 R24-R26 R34-R36 R44-R46 R54-R56 = RES_0805_15K: Manufacturer: TE Connectivity; Manufacturer Part Number: 1625856-2; Tolerance: ±10%; Power (Watts): 0.125W, 1/8W; Temperature Coefficient: ±100ppm/°C; RoHS: RoHS Compliant; Category: Resistors; Packaging: Cut Tape (CT); Resistance (Ohms): 15K; Composition: Thick Film; Features: -; Operating Temperature: -55°C ~ 125°C; Package / Case: 0805 (2012 Metric); Supplier Device Package: 0805; Size / Dimension: 0.079" L x 0.047" W (2.00mm x 1.20mm); Height: 0.020" (0.50mm); Number of Terminations: 2; ComponentLink1URL: http://www.te.com/commerce/DocumentDelivery/DDEController?Action=srchrtrv&DocNm=1625856&DocType=Customer+Drawing&DocLang=English; ComponentLink1Description: http://www.te.com/commerce/DocumentDelivery/DDEController?Action=srchrtrv&DocNm=1625856&DocType=Customer+Drawing&DocLang=English; Value: 15K; Supplier 1: Digi-Key; Supplier Part Number 1: 311-15.0KCRCT-ND
Rf11 Rf12 Rf21 Rf22 Rf31 Rf32 Rf41 Rf42 Rf51 Rf52 = RES_0805_1K: Manufacturer: TE Connectivity; Manufacturer Part Number: 1625856-2; Resistance (Ohms): 100M; Tolerance: ±10%; Power (Watts): 0.125W, 1/8W; Temperature Coefficient: ±100ppm/°C; Supplier 1: Digi-Key; RoHS: RoHS Compliant; Category: Resistors; Packaging: Cut Tape (CT); Composition: Thick Film; Features: -; Operating Temperature: -55°C ~ 125°C; Package / Case: 0805 (2012 Metric); Supplier Device Package: 0805; Size / Dimension: 0.079" L x 0.047" W (2.00mm x 1.20mm); Height: 0.020" (0.50mm); Number of Terminations: 2; ComponentLink1URL: http://www.te.com/commerce/DocumentDelivery/DDEController?Action=srchrtrv&DocNm=1625856&DocType=Customer+Drawing&DocLang=English; ComponentLink1Description: http://www.te.com/commerce/DocumentDelivery/DDEController?Action=srchrtrv&DocNm=1625856&DocType=Customer+Drawing&DocLang=English; Supplier Part Number 1: P1.00KCCT-ND; Value: 1K
Rs1-Rs5 = RES_0805_01: Manufacturer: TE Connectivity; Manufacturer Part Number: 1625856-2; Resistance (Ohms): 100M; Tolerance: ±10%; Power (Watts): 0.125W, 1/8W; Temperature Coefficient: ±100ppm/°C; Supplier 1: Digi-Key; RoHS: RoHS Compliant; Category: Resistors; Packaging: Cut Tape (CT); Composition: Thick Film; Features: -; Operating Temperature: -55°C ~ 125°C; Package / Case: 0805 (2012 Metric); Supplier Device Package: 0805; Size / Dimension: 0.079" L x 0.047" W (2.00mm x 1.20mm); Height: 0.020" (0.50mm); Number of Terminations: 2; ComponentLink1URL: http://www.te.com/commerce/DocumentDelivery/DDEController?Action=srchrtrv&DocNm=1625856&DocType=Customer+Drawing&DocLang=English; ComponentLink1Description: http://www.te.com/commerce/DocumentDelivery/DDEController?Action=srchrtrv&DocNm=1625856&DocType=Customer+Drawing&DocLang=English; Supplier Part Number 1: RL12T.010JCT-ND; Value: 0.01
U11 U21 U31 U41 U51 = SPV1040: Manufacturer: STMicroelectronics; Function: Charge Management, Solar; Voltage - Supply: 0.3 V ~ 5.5 V; Supplier 1: Digi-Key; RoHS: RoHS Compliant; Category: Integrated Circuits (ICs); Stock 1: 10; Pricing 1: 1=5.14, 10=4.584 (CAD); Packaging: Tube; Battery Chemistry: -; Operating Temperature: -40°C ~ 85°C; Mounting Type: Surface Mount; Package / Case: 8-TSSOP (0.173", 4.40mm Width); Supplier Device Package: 8-TSSOP; ComponentLink1URL: http://www.st.com/web/en/resource/technical/document/datasheet/CD00287506.pdf; ComponentLink1Description: http://www.st.com/web/en/resource/technical/document/datasheet/CD00287506.pdf; Supplier Part Number 1: 497-11417-ND
U12 U22 U32 U42 U52 = L6924D013TR: IC BATT CHRGR ION/POLY 16-VFQFPN; Manufacturer: STMicroelectronics; Function: Charge Management; Battery Chemistry: Li-Ion, Li-Pol; Voltage - Supply: 2.5 V ~ 12 V; Supplier 1: Digi-Key; Manufacturer Part Number: L6924D013TR; RoHS: RoHS Compliant; Category: Integrated Circuits (ICs); Stock 1: 3342; Pricing 1: 1=2.74, 10=2.477, 25=2.2188, 100=1.9951, 250=1.77148, 500=1.54788, 1000=1.2813 (CAD); Packaging: Cut Tape (CT); Operating Temperature: -40°C ~ 125°C; Mounting Type: Surface Mount; Package / Case: 16-VFQFN; Supplier Device Package: 16-VFQFP-N (3x3); ComponentLink1URL: http://www.st.com/web/en/resource/technical/document/datasheet/CD00079821.pdf; ComponentLink1Description: http://www.st.com/web/en/resource/technical/document/datasheet/CD00079821.pdf; Supplier Part Number 1: 497-5100-1-ND

## Sheet power_board_uC.SchDoc
size A4
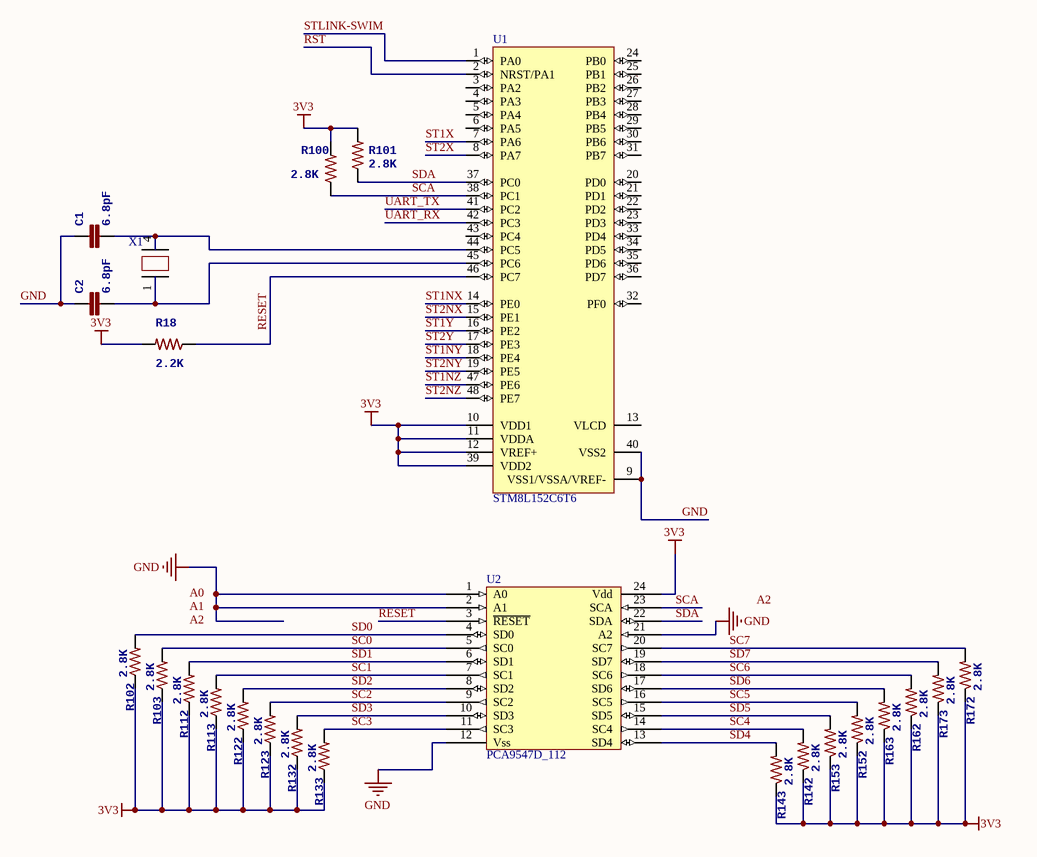
[diagram p4: power_board_uC.SchDoc]

### Parts
(Parts that share a designator on the sheet are numbered #1, #2 ... from top to bottom, then left to right.)
C1#1  6.8pF  [0402-CAP]
C2  6.8pF  [0402-CAP]
R18  2.2K  [0805]
R100  2.8K  [0805]
R101  2.8K  [0805]
R102  2.8K  [0805]
R103  2.8K  [0805]
R112  2.8K  [0805]
R113  2.8K  [0805]
R122  2.8K  [0805]
R123  2.8K  [0805]
R132  2.8K  [0805]
R133  2.8K  [0805]
R142  2.8K  [0805]
R143  2.8K  [0805]
R152  2.8K  [0805]
R153  2.8K  [0805]
R162  2.8K  [0805]
R163  2.8K  [0805]
R172  2.8K  [0805]
R173  2.8K  [0805]
U1#1  STM8L152C6T6  [LQFP48_M]
U2  PCA9547D_112  [TSOP65P640X110-24N]
X1  XTAL_32MHz  [SOJ550P350X254-4M]  (value not drawn)

### Nets
3V3: R18.2 R100.2 R101.2 R102.1 R103.1 R112.1 R113.1 R122.1 R123.1 R132.1 R133.1 R142.1 R143.1 R152.1 R153.1 R162.1 R163.1 R172.1 R173.1 U1#1.10(VDD1) U1#1.11(VDDA) U1#1.12(VREF+) U1#1.39(VDD2) U2.24(Vdd)
GND: C1#1.1 C2.1 U1#1.9(VSS1/VSSA/VREF-) U1#1.40(VSS2) U2.1(A0) U2.2(A1) U2.12(Vss) U2.21(A2)  [project net ARRAYNX.3.NEG.NEG]
RESET: R18.1 U1#1.46(PC7) U2.3(~{RESET})
RST: U1#1.2(NRST/PA1)
SC0: R103.2 U2.5(SC0)
SC1: R113.2 U2.7(SC1)
SC2: R123.2 U2.9(SC2)
SC3: R133.2 U2.11(SC3)
SC4: R142.2 U2.14(SC4)
SC5: R152.2 U2.16(SC5)
SC6: R162.2 U2.18(SC6)
SC7: R172.2 U2.20(SC7)
SCA: R100.1 U1#1.38(PC1) U2.23(SCA)
SD0: R102.2 U2.4(SD0)
SD1: R112.2 U2.6(SD1)
SD2: R122.2 U2.8(SD2)
SD3: R132.2 U2.10(SD3)
SD4: R143.2 U2.13(SD4)
SD5: R153.2 U2.15(SD5)
SD6: R163.2 U2.17(SD6)
SD7: R173.2 U2.19(SD7)
SDA: R101.1 U1#1.37(PC0) U2.22(SDA)
ST1NX: U1#1.14(PE0)
ST1NY: U1#1.18(PE4)
ST1NZ: U1#1.47(PE6)
ST1X: U1#1.7(PA6)
ST1Y: U1#1.16(PE2)
ST2NX: U1#1.15(PE1)
ST2NY: U1#1.19(PE5)
ST2NZ: U1#1.48(PE7)
ST2X: U1#1.8(PA7)
ST2Y: U1#1.17(PE3)
STLINK-SWIM: U1#1.1(PA0)
UART_RX: U1#1.42(PC3)
UART_TX: U1#1.41(PC2)
NetC1#1_2: C1#1.2 U1#1.44(PC5) X1.4
NetC2_2: C2.2 U1#1.45(PC6) X1.1

Not connected (* = marked no-connect by the designer): U1#1 3(PA2) 4(PA3) 5(PA4) 6(PA5) 13(VLCD) 20(PD0) 21(PD1) 22(PD2) 23(PD3) 24(PB0) 25(PB1) 26(PB2) 27(PB3) 28(PB4) 29(PB5) 30(PB6) 31(PB7) 32(PF0) 33(PD4) 34(PD5) 35(PD6) 36(PD7) 43(PC4)

### Notes on the sheet
- Labels drawn without touching a wire or pin: A0, A1, A2

### Library data of the parts
C1#1 C2 = CAP0402-6_8pF: Value: 6.8pF; Supplier 1: Digi-Key; Supplier Part Number 1: 490-5950-1-ND
R18 = RES_0805_2k2: Manufacturer: TE Connectivity; Manufacturer Part Number: 1625856-2; Resistance (Ohms): 100M; Tolerance: ±10%; Power (Watts): 0.125W, 1/8W; Temperature Coefficient: ±100ppm/°C; RoHS: RoHS Compliant; Category: Resistors; Packaging: Cut Tape (CT); Composition: Thick Film; Features: -; Operating Temperature: -55°C ~ 125°C; Package / Case: 0805 (2012 Metric); Supplier Device Package: 0805; Size / Dimension: 0.079" L x 0.047" W (2.00mm x 1.20mm); Height: 0.020" (0.50mm); Number of Terminations: 2; ComponentLink1URL: http://www.te.com/commerce/DocumentDelivery/DDEController?Action=srchrtrv&DocNm=1625856&DocType=Customer+Drawing&DocLang=English; ComponentLink1Description: http://www.te.com/commerce/DocumentDelivery/DDEController?Action=srchrtrv&DocNm=1625856&DocType=Customer+Drawing&DocLang=English; Value: 2.2K; Supplier 1: Digi-Key; Supplier Part Number 1: 311-42.2KCRCT-ND
R100-R103 R112 R113 R122 R123 R132 R133 R142 R143 R152 R153 R162 R163 R172 R173 = RES_0805_2k8: Manufacturer: TE Connectivity; Manufacturer Part Number: 1625856-2; Resistance (Ohms): 100M; Tolerance: ±10%; Power (Watts): 0.125W, 1/8W; Temperature Coefficient: ±100ppm/°C; RoHS: RoHS Compliant; Category: Resistors; Packaging: Cut Tape (CT); Composition: Thick Film; Features: -; Operating Temperature: -55°C ~ 125°C; Package / Case: 0805 (2012 Metric); Supplier Device Package: 0805; Size / Dimension: 0.079" L x 0.047" W (2.00mm x 1.20mm); Height: 0.020" (0.50mm); Number of Terminations: 2; ComponentLink1URL: http://www.te.com/commerce/DocumentDelivery/DDEController?Action=srchrtrv&DocNm=1625856&DocType=Customer+Drawing&DocLang=English; ComponentLink1Description: http://www.te.com/commerce/DocumentDelivery/DDEController?Action=srchrtrv&DocNm=1625856&DocType=Customer+Drawing&DocLang=English; Value: 2.8K; Supplier 1: Digi-Key; Supplier Part Number 1: P2.80KCCT-ND
U1#1 = CMP-0235-00048-1: STM8L ARM-based EnergyLite 8-bit MCU, LCD, 32 kB Flash, 2 kB Internal RAM, -40 to +85°C Temperature, 48-pin LQFP, Tray; ComponentLink1URL: http://www.st.com/internet/com/TECHNICAL_RESOURCES/TECHNICAL_LITERATURE/DATASHEET/CD00240181.pdf; ComponentLink2Description: STM8L Family Web Page; ComponentLink3URL: http://www.st.com/internet/com/home/home.jsp; ComponentLink1Description: STM8L151/152,x4,x6 Datasheet; PackageVersion: rev13, Apr-2011; PackageDescription: 48-Pin Low-Profile Quad Flat Pack, 7 x 7 mm Body, 0.5 mm Pitch (LQFP48); PackageReference: LQFP48; ComponentLink2URL: http://www.st.com/internet/mcu/subclass/1381.jsp; ComponentLink3Description: st.com Home; Supplier 1: Digi-Key; Supplier Part Number 1: 497-10512-ND
U2 = PCA9547D_112: Supplier 1: Digi-Key; Supplier Part Number 1: 568-11921-1-ND
X1 = XTAL_32MHz: Supplier 1: Digi-Key; Supplier Part Number 1: SER2417CT-ND

## Sheet Power_Sys_Toplvl.SchDoc
size A2
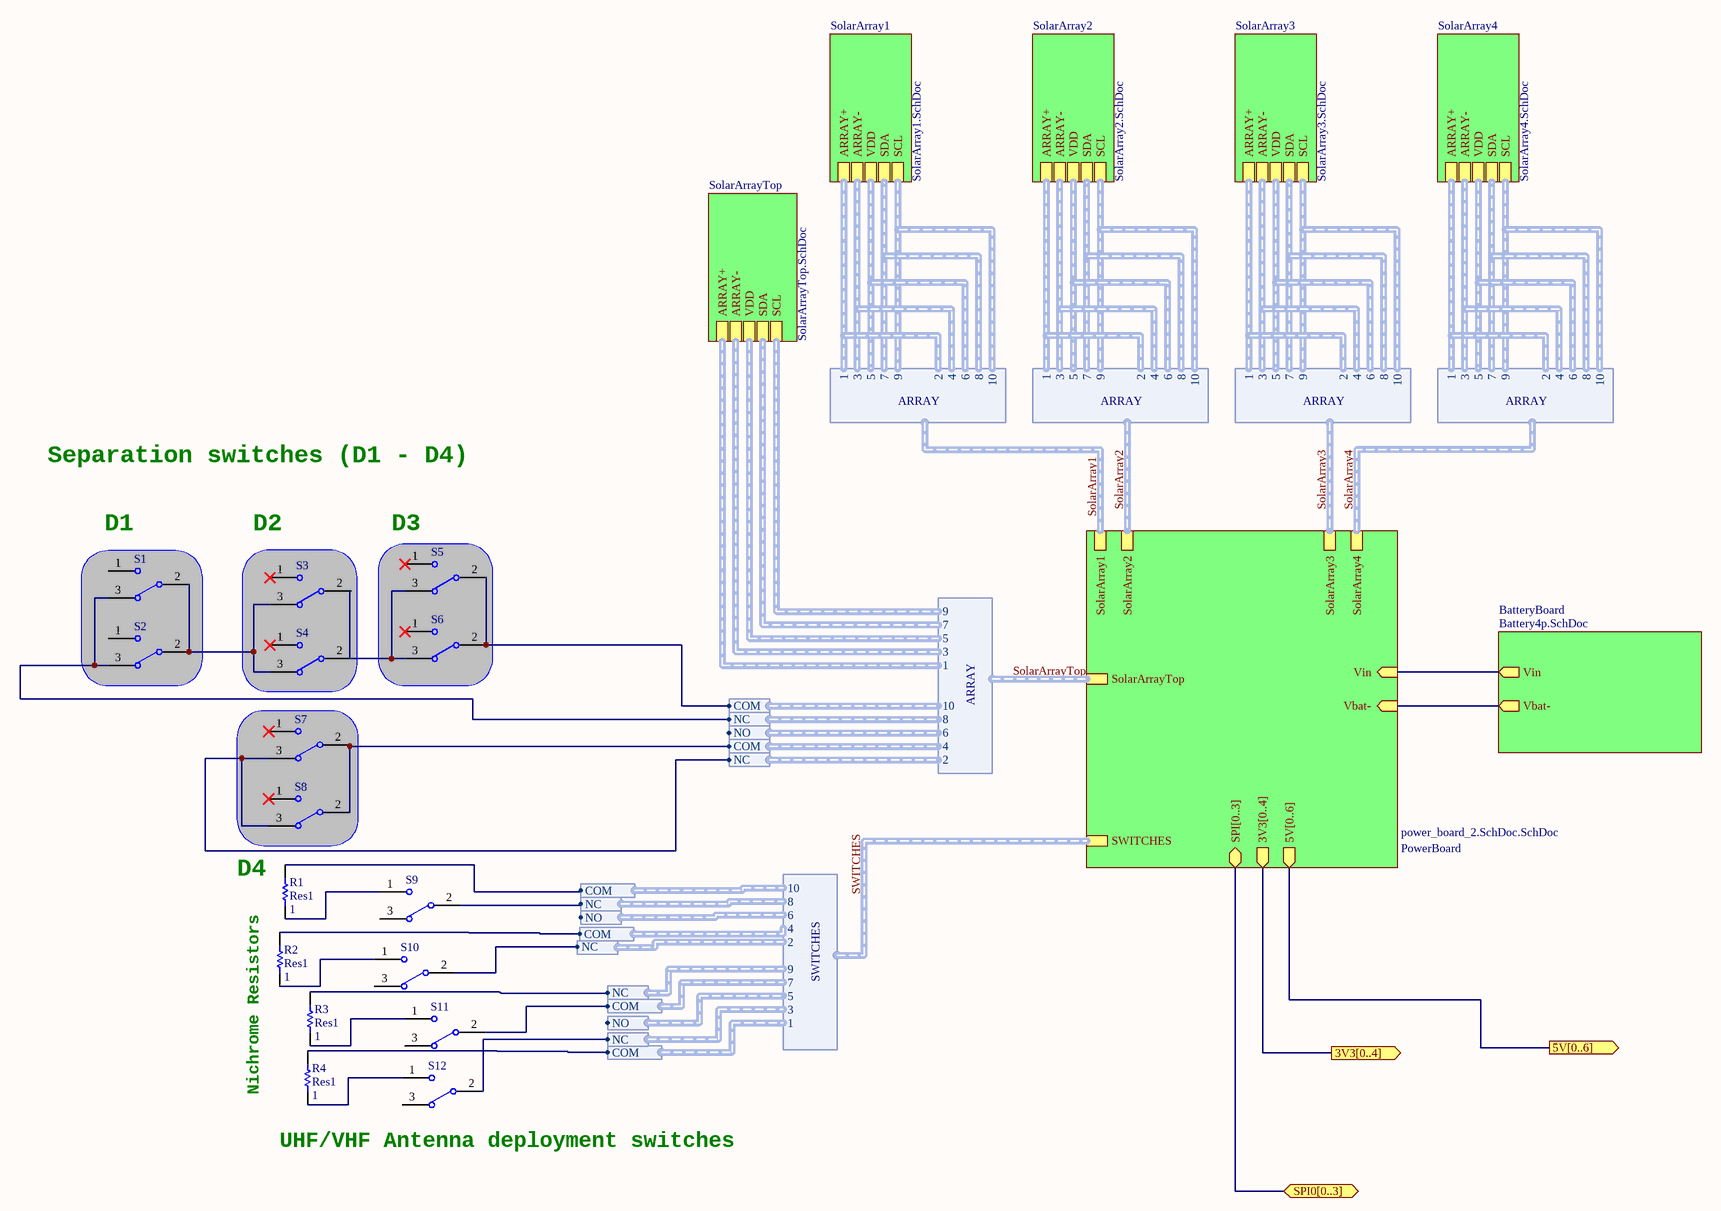
[diagram p5: Power_Sys_Toplvl.SchDoc]

### Parts
(Parts that share a designator on the sheet are numbered #1, #2 ... from top to bottom, then left to right.)
R1#2  Res1  value 1  [AXIAL-0.3]
R2#1  Res1  value 1  [AXIAL-0.3]
R3#2  Res1  value 1  [AXIAL-0.3]
R4#1  Res1  value 1  [AXIAL-0.3]
S1  SW-SPDT  [TL36WW15050]  (value not drawn)
S2  SW-SPDT  [TL36WW15050]  (value not drawn)
S3  SW-SPDT  [TL36WW15050]  (value not drawn)
S4  SW-SPDT  [TL36WW15050]  (value not drawn)
S5  SW-SPDT  [TL36WW15050]  (value not drawn)
S6  SW-SPDT  [TL36WW15050]  (value not drawn)
S7  SW-SPDT  [TL36WW15050]  (value not drawn)
S8  SW-SPDT  [TL36WW15050]  (value not drawn)
S9  SW-SPDT  [TL36WW15050]  (value not drawn)
S10  SW-SPDT  [TL36WW15050]  (value not drawn)
S11  SW-SPDT  [TL36WW15050]  (value not drawn)
S12  SW-SPDT  [TL36WW15050]  (value not drawn)

### Blocks framed on the sheet
D1: S1 S2
D2: S3 S4
D3: S5 S6

### Sub-sheets
BatteryBoard = Battery4p.SchDoc: Vbat- (out), Vin (out)
PowerBoard = power_board_2.SchDoc.SchDoc: SPI[0..3] (bidir), SolarArray1 (harness ARRAY), SolarArray2 (harness ARRAY), SolarArray3 (harness ARRAY), SolarArray4 (harness ARRAY), SolarArrayTop (harness ARRAY), SWITCHES (harness SWITCHES), Vin (in), Vbat- (in), 3V3[0..4] (out), 5V[0..6] (out)
SolarArray1 = SolarArray1.SchDoc: ARRAY+ (harness ARRAY+), ARRAY- (harness ARRAY-), VDD (harness VDD), SDA (harness SDA), SCL (harness SCL)
SolarArray2 = SolarArray2.SchDoc: ARRAY+ (harness ARRAY+), ARRAY- (harness ARRAY-), VDD (harness VDD), SDA (harness SDA), SCL (harness SCL)
SolarArray3 = SolarArray3.SchDoc: ARRAY+ (harness ARRAY+), ARRAY- (harness ARRAY-), VDD (harness VDD), SDA (harness SDA), SCL (harness SCL)
SolarArray4 = SolarArray4.SchDoc: ARRAY+ (harness ARRAY+), ARRAY- (harness ARRAY-), VDD (harness VDD), SDA (harness SDA), SCL (harness SCL)
SolarArrayTop = SolarArrayTop.SchDoc: ARRAY+ (harness ARRAY+), ARRAY- (harness ARRAY-), VDD (harness VDD), SDA (harness SDA), SCL (harness SCL)

### Ports
3V3[0..4] (out), 5V[0..6] (out), SPI0[0..3] (bidir)

### Harnesses
ARRAY: 1, 3, 5, 7, 9, 2, 4, 6, 8, 10
ARRAY: 1, 10, 2, 3, 4, 5, 6, 7, 8, 9
SEPCOM: COM
SEPNC: NC
COM: COM
NC: NC
NO: NC
NO: NO
SWITCHES: 1, 10, 2, 3, 4, 5, 6, 7, 8, 9

### Nets
ANTENNA: R4#1.2 ; harness COM.COM
SWITCHES.3.NC.NC: S11.2 S12.2 ; harness COM.COM, harness NC.NC
Vbat-: sheet PowerBoard/Vbat-, sheet BatteryBoard/Vbat-
Vin: sheet PowerBoard/Vin, sheet BatteryBoard/Vin
NetR1#2_1: R1#2.1 S9.1
NetR1#2_2: R1#2.2 ; harness COM.COM
NetR2#1_1: R2#1.1 S10.1
NetR2#1_2: R2#1.2 ; harness COM.COM
NetR3#2_1: R3#2.1 S11.1
NetR3#2_2: R3#2.2 ; harness NO.NC
NetR4#1_1: R4#1.1 S12.1
NetS1_2: S1.2 S2.2 S3.3 S4.3
NetS1_3: S1.3 S2.3 ; harness SEPNC.NC
NetS4_2: S4.2 S5.3 S6.3
NetS5_2: S5.2 S6.2 ; harness SEPCOM.COM
NetS7_2: S7.2 S8.2 ; harness SEPCOM.COM
NetS7_3: S7.3 S8.3 ; harness SEPNC.NC
NetS9_2: S9.2 ; harness NC.NC
NetS10_2: S10.2 ; harness NC.NC

Not connected (* = marked no-connect by the designer): S1 1; S2 1; S3 1* 2; S4 1*; S5 1*; S6 1*; S7 1*; S8 1*; S9 3; S10 3; S11 3; S12 3

### Buses and harness runs
bus port 3V3[0..4] = sheet PowerBoard/3V3[0..4]
bus port 5V[0..6] = sheet PowerBoard/5V[0..6]
bus port SPI0[0..3] = sheet PowerBoard/SPI[0..3]
harness SolarArray1 = sheet PowerBoard/SolarArray1
harness SolarArray2 = sheet PowerBoard/SolarArray2
harness SolarArray3 = sheet PowerBoard/SolarArray3
harness SolarArray4 = sheet PowerBoard/SolarArray4
harness SolarArrayTop = sheet PowerBoard/SolarArrayTop
harness SWITCHES = sheet PowerBoard/SWITCHES

### Notes on the sheet
- Separation switches (D1 - D4)
- (near R1#2) D4
- (near R2#1) Nichrome Resistors
- UHF/VHF Antenna deployment switches

### Library data of the parts
R1#2 R2#1 R3#2 R4#1 = Res1: Resistor; Published: 8-Jun-2000; LatestRevisionDate: 17-Jul-2002; LatestRevisionNote: Re-released for DXP Platform.; PackageReference: AXIAL-0.3; Publisher: Altium Limited; PackageDescription: Axial Device, Thru-Hole; 2 Leads; 0.3 in Pin Spacing
S1-S12 = SW-SPDT: SPDT Subminiature Toggle Switch, Right Angle Mounting, Vertical Actuation; Published: 24-Mar-1999; LatestRevisionDate: 17-Dec-2003; LatestRevisionNote: Schematic revised, PCB Footprint replaced.; DatasheetVersion: 05-Dec-2000; PackageReference: TL36WW15050; Publisher: Altium Limited; PackageDescription: Switch; 4 Leads; ComponentLink1Description: Manufacturer Link; ComponentLink1URL: http://www.apem.com; Supplier 1: Digi-Key; Supplier Part Number 1: 255-3400-ND